# EAGLE design homeboard18 (EAGLE 6.0)
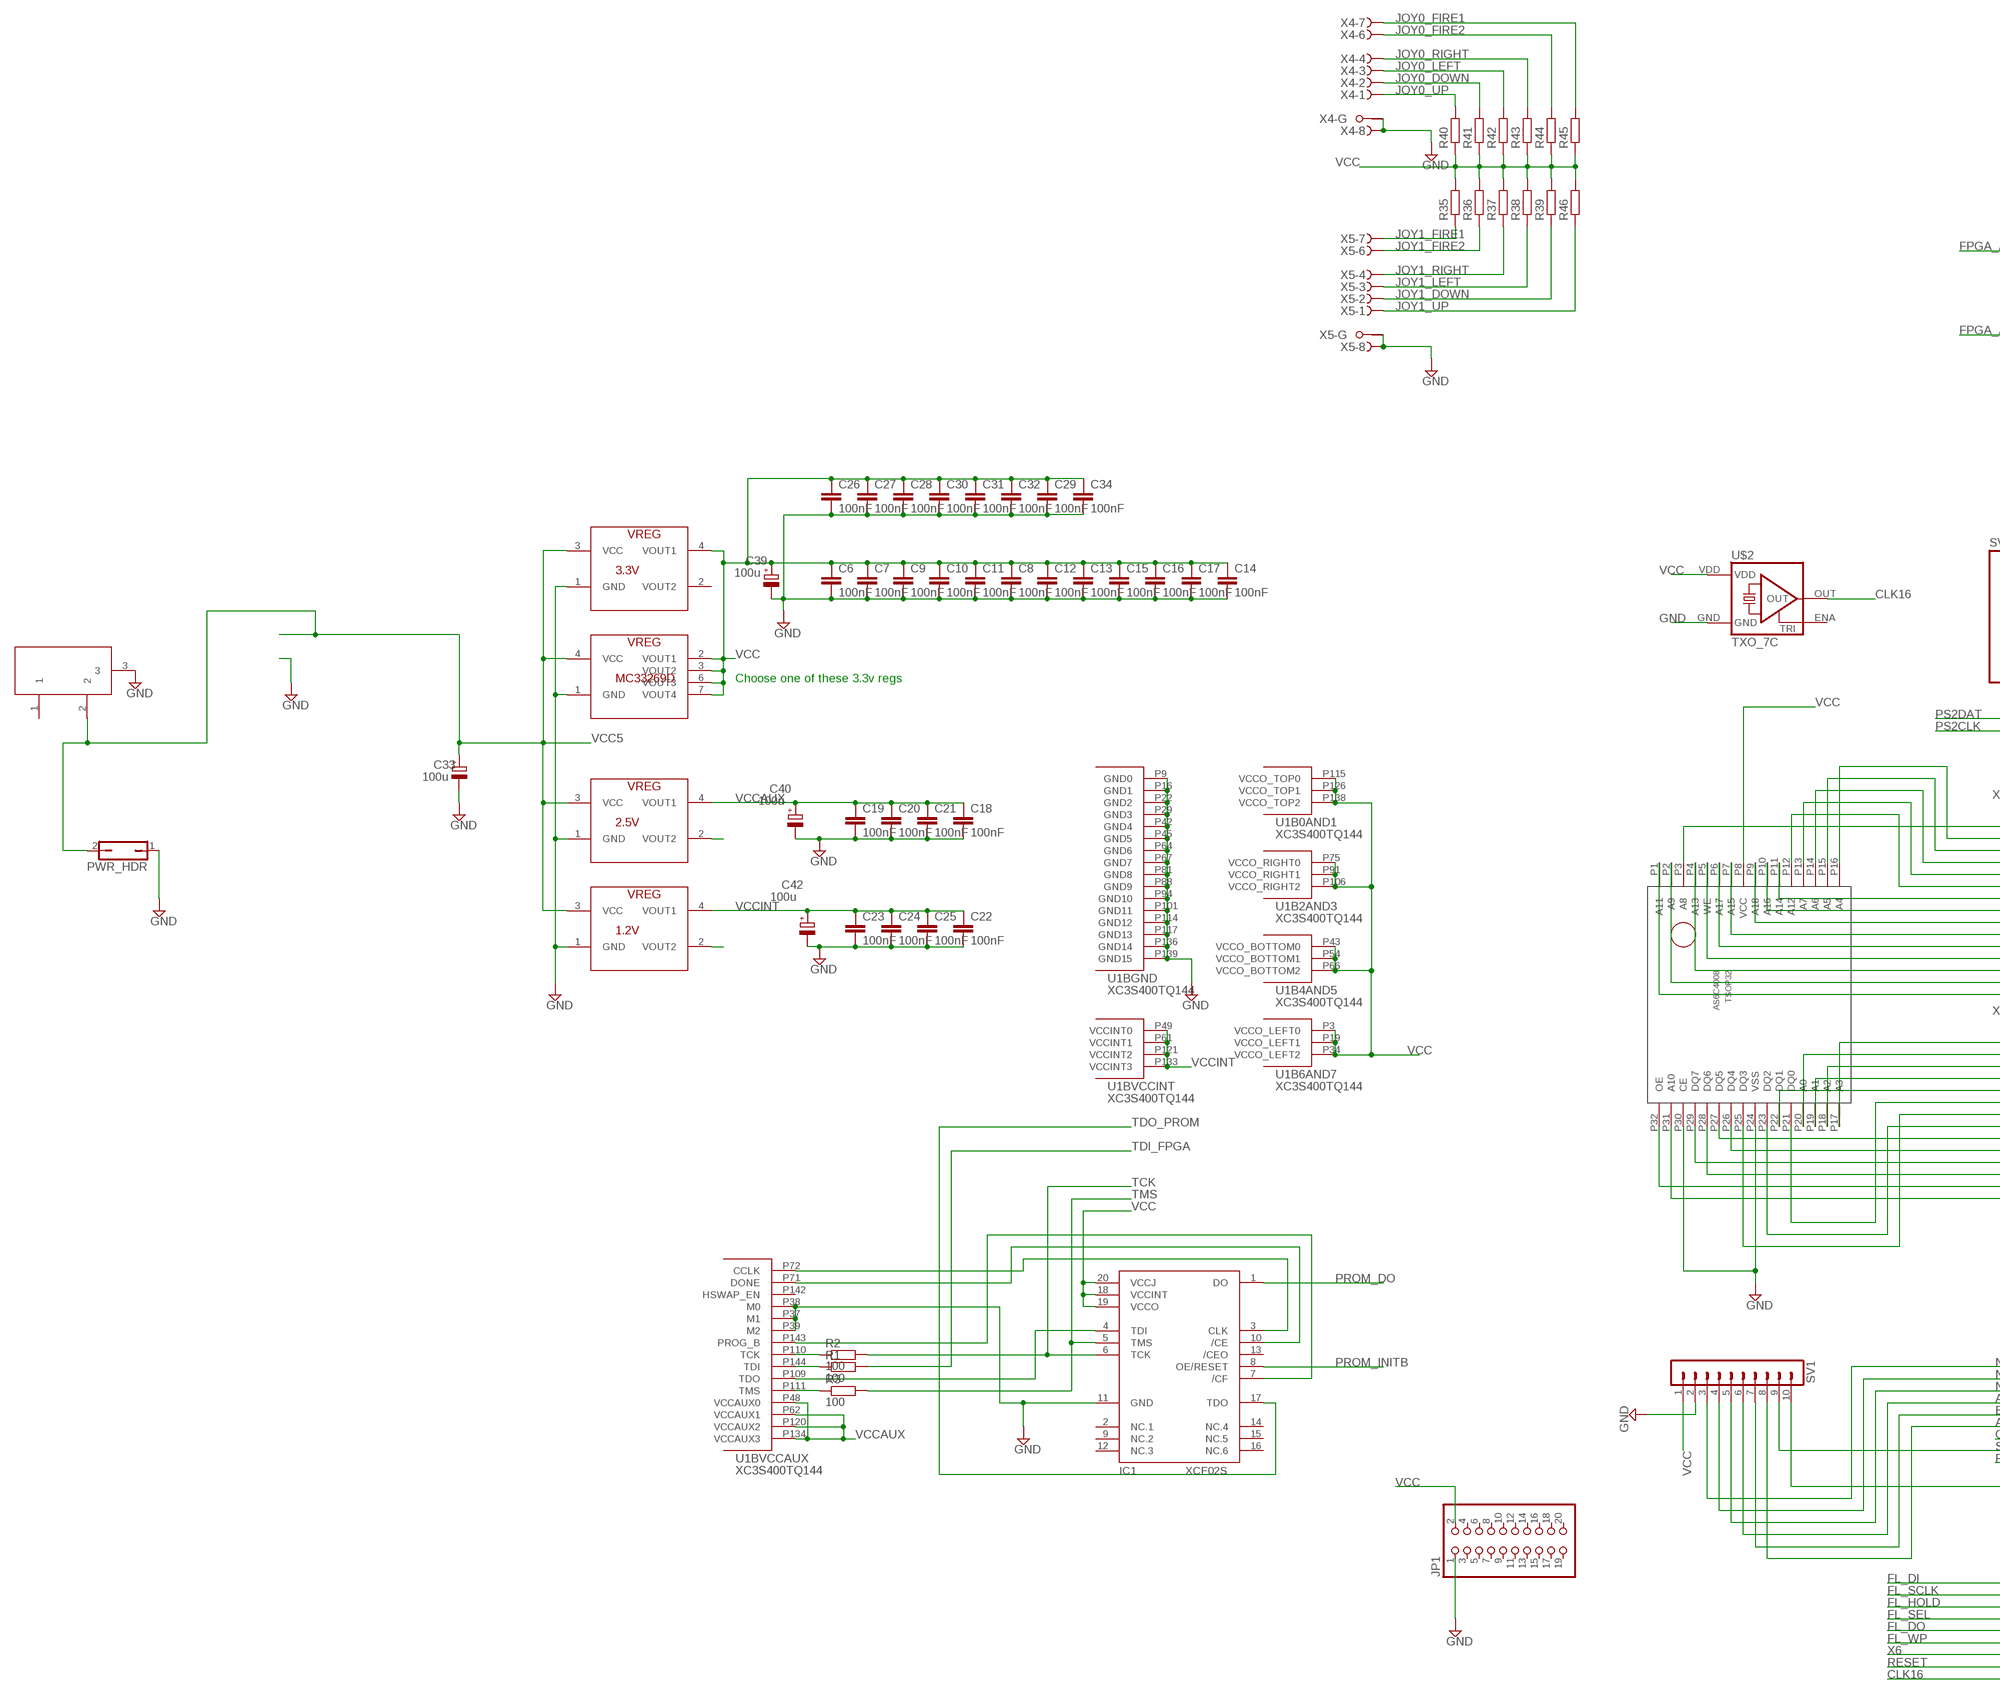
[diagram p0: schematic, sheet 1, part 1 of 3]
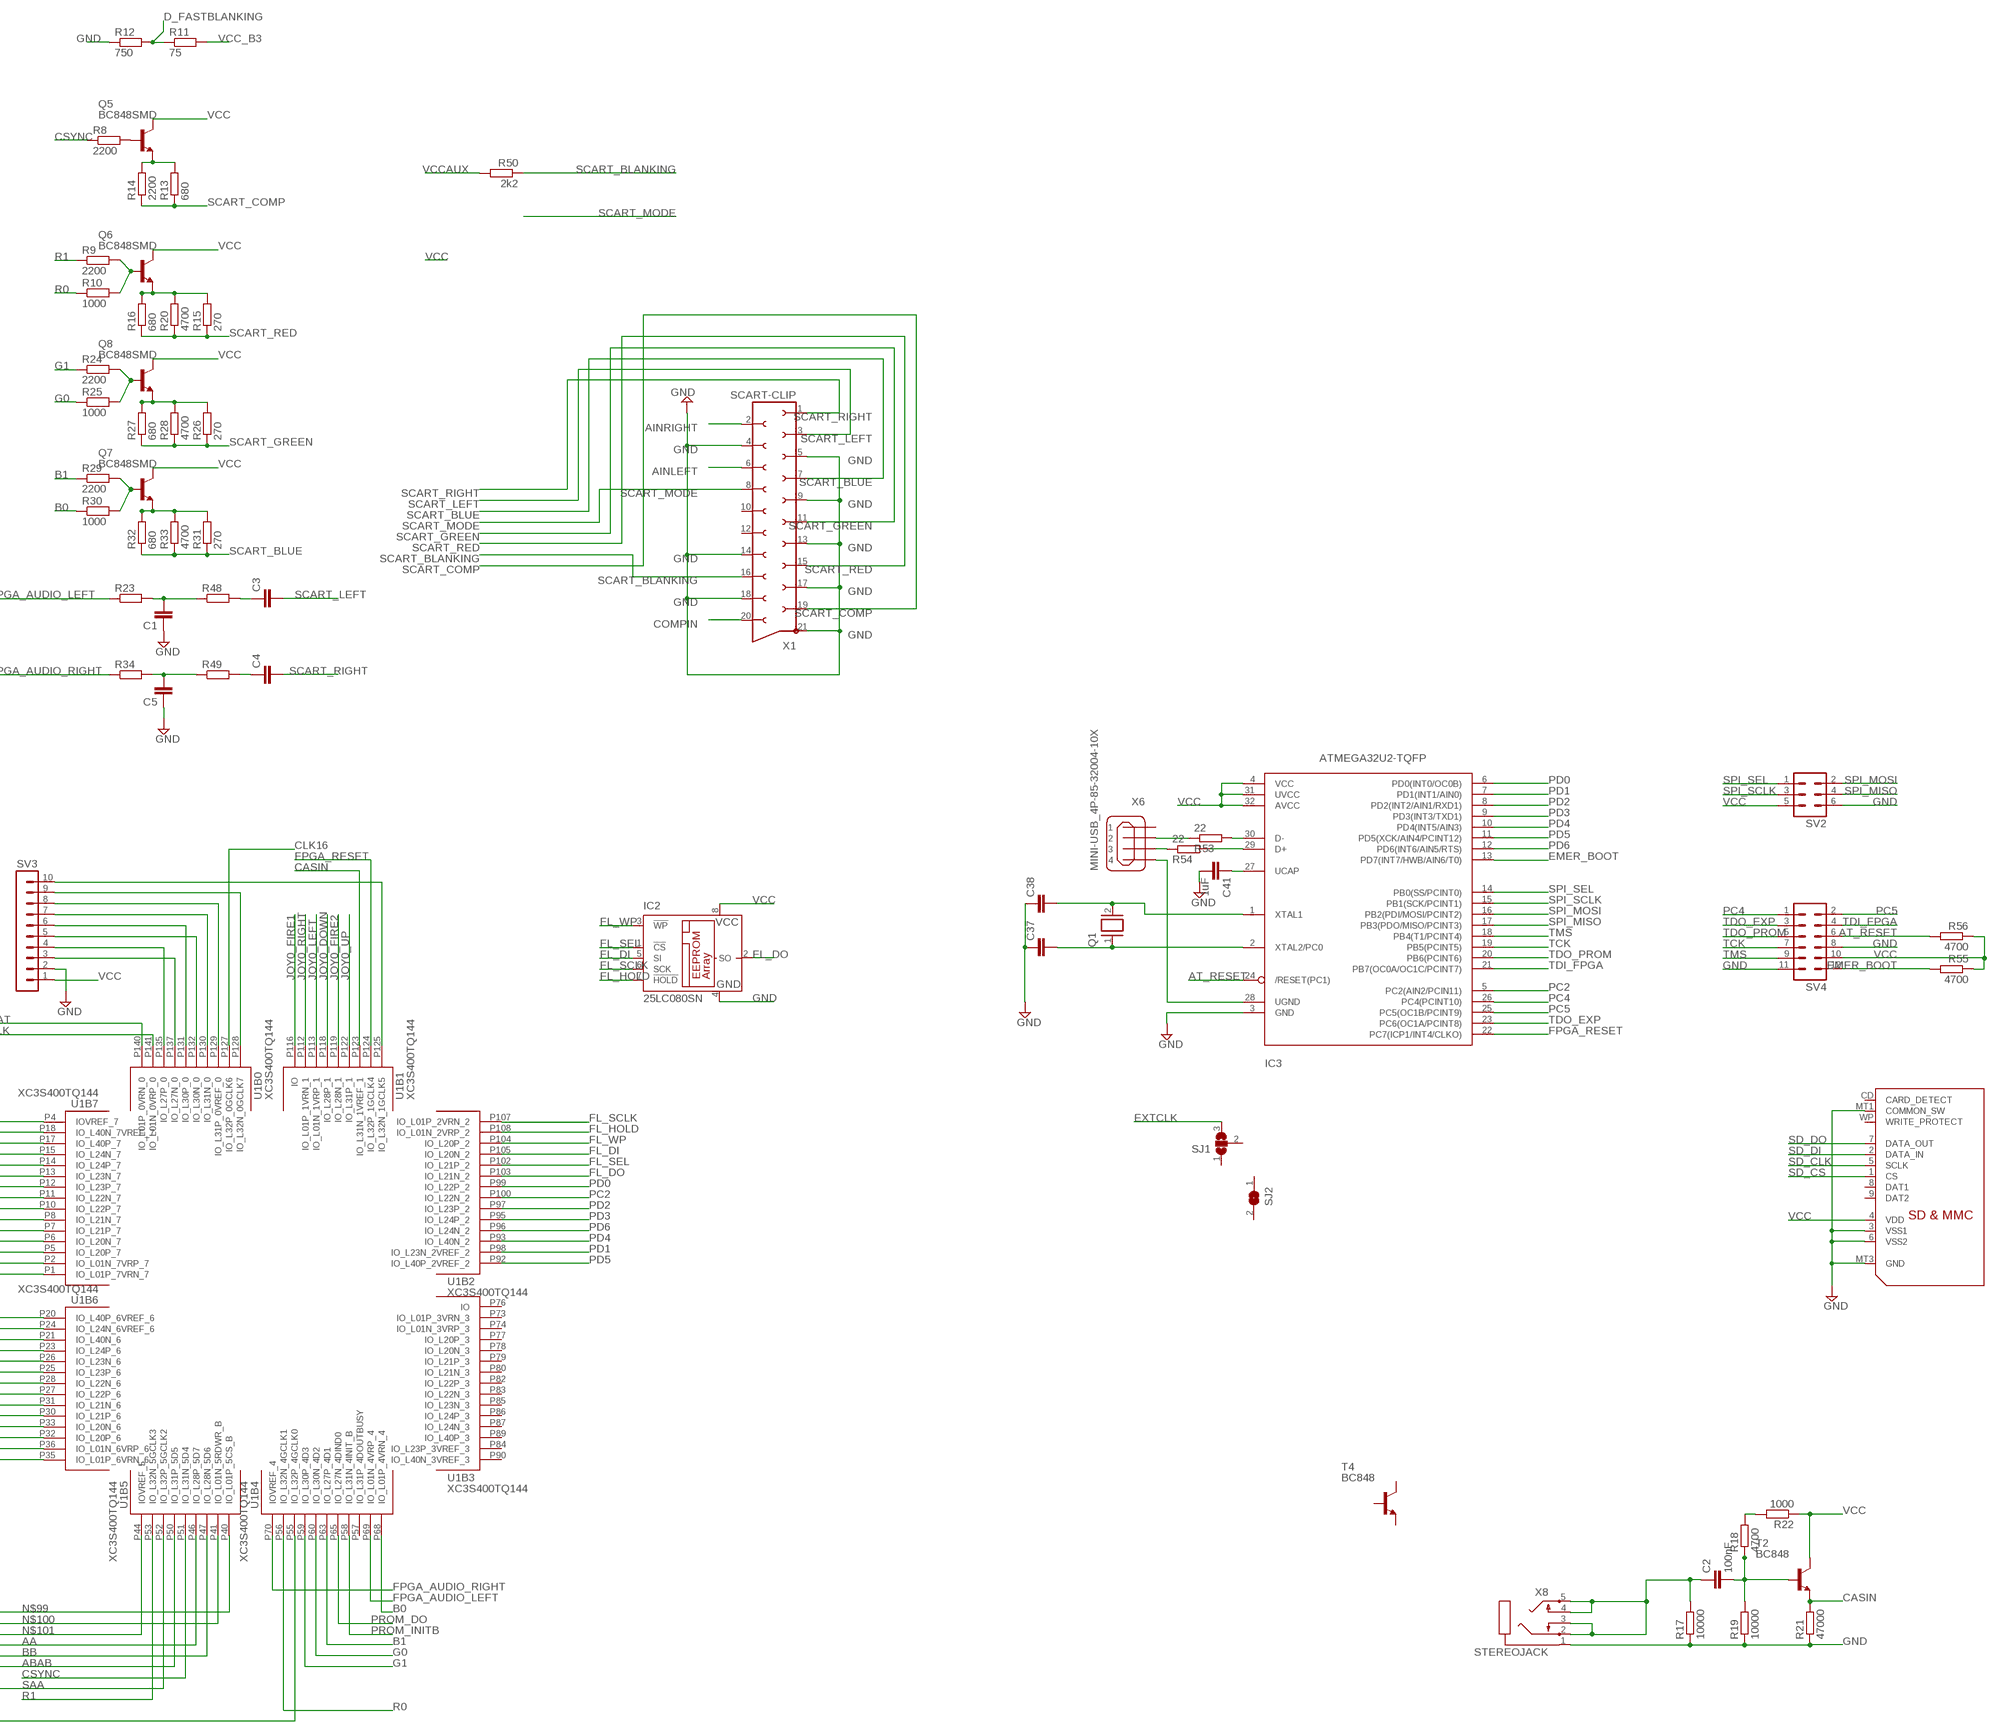
[diagram p1: schematic, sheet 1, part 2 of 3]
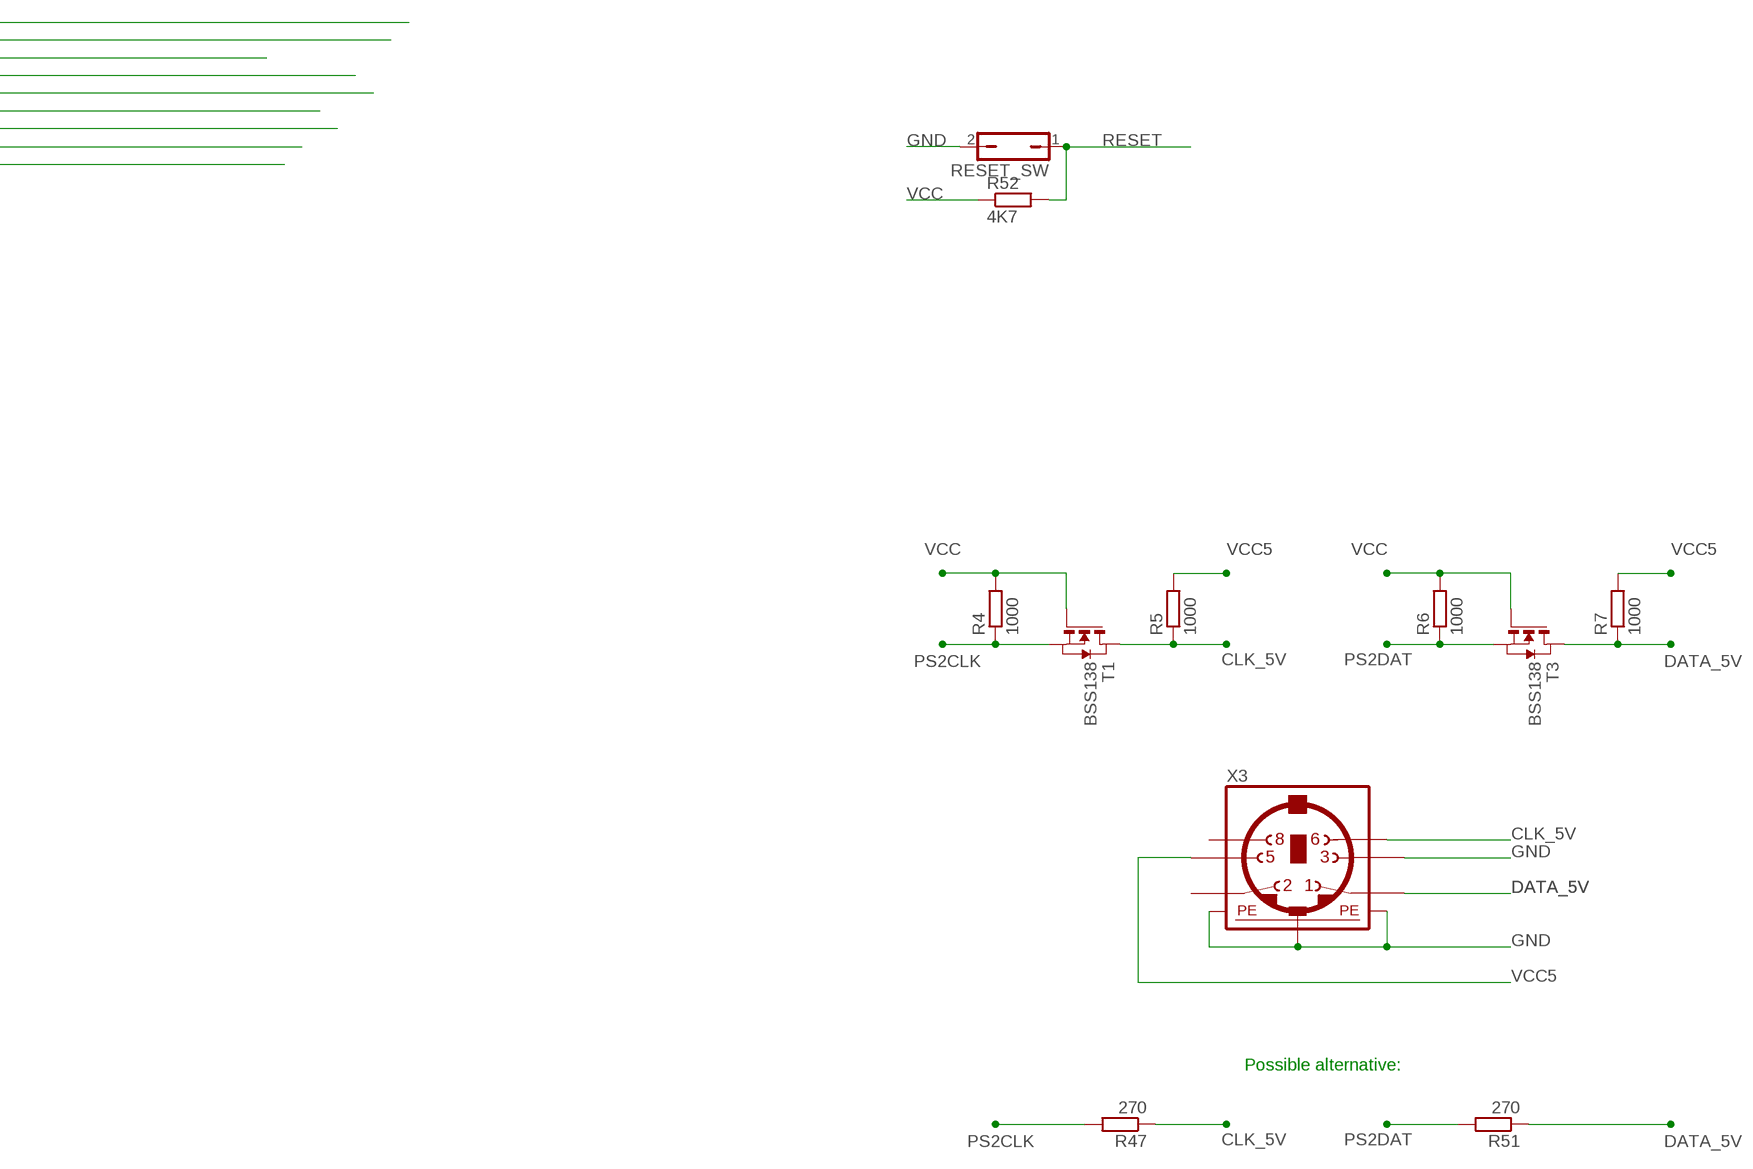
[diagram p2: schematic, sheet 1, part 3 of 3]

## Parts
C1  C-EUC0603  [C0603]
C2  100nF  C-EUC0603  [C0603]
C3  C-EUC0603  [C0603]
C4  C-EUC0603  [C0603]
C5  C-EUC0603  [C0603]
C6  100nF  C-EUC0603  [C0603]
C7  100nF  C-EUC0603  [C0603]
C8  100nF  C-EUC0603  [C0603]
C9  100nF  C-EUC0603  [C0603]
C10  100nF  C-EUC0603  [C0603]
C11  100nF  C-EUC0603  [C0603]
C12  100nF  C-EUC0603  [C0603]
C13  100nF  C-EUC0603  [C0603]
C14  100nF  C-EUC0603  [C0603]
C15  100nF  C-EUC0603  [C0603]
C16  100nF  C-EUC0603  [C0603]
C17  100nF  C-EUC0603  [C0603]
C18  100nF  C-EUC0603  [C0603]
C19  100nF  C-EUC0603  [C0603]
C20  100nF  C-EUC0603  [C0603]
C21  100nF  C-EUC0603  [C0603]
C22  100nF  C-EUC0603  [C0603]
C23  100nF  C-EUC0603  [C0603]
C24  100nF  C-EUC0603  [C0603]
C25  100nF  C-EUC0603  [C0603]
C26  100nF  C-EUC0603  [C0603]
C27  100nF  C-EUC0603  [C0603]
C28  100nF  C-EUC0603  [C0603]
C29  100nF  C-EUC0603  [C0603]
C30  100nF  C-EUC0603  [C0603]
C31  100nF  C-EUC0603  [C0603]
C32  100nF  C-EUC0603  [C0603]
C33  100u  CPOL-EUD  [PANASONIC_D]
C34  100nF  C-EUC0603  [C0603]
C37  C-EUC0805  [C0805]
C38  C-EUC0805  [C0805]
C39  100u  CPOL-EUD  [PANASONIC_D]
C40  100u  CPOL-EUD  [PANASONIC_D]
C41  1uF  C-EUC0805  [C0805]
C42  100u  CPOL-EUD  [PANASONIC_D]
IC1  XCF02S  [VO20]
IC2  25LC080SN  [SO-08]
IC3  ATMEGA32U2-TQFP  [TQFP32-08]
JP1  PINHD-2X10  [2X10]
PWR_HDR  JP1Q  [JP1]
Q1  XTAL/S  [QS]
Q5  BC848SMD  [SOT23]
Q6  BC848SMD  [SOT23]
Q7  BC848SMD  [SOT23]
Q8  BC848SMD  [SOT23]
R1  100  R-EU_R0805  [R0805]
R2  100  R-EU_R0805  [R0805]
R3  100  R-EU_R0805  [R0805]
R4  1000  R-EU_R0805  [R0805]
R5  1000  R-EU_R0805  [R0805]
R6  1000  R-EU_R0805  [R0805]
R7  1000  R-EU_R0805  [R0805]
R8  2200  R-EU_R0805  [R0805]
R9  2200  R-EU_R0805  [R0805]
R10  1000  R-EU_R0805  [R0805]
R11  75  R-EU_R0805  [R0805]
R12  750  R-EU_R0805  [R0805]
R13  680  R-EU_R0805  [R0805]
R14  2200  R-EU_R0805  [R0805]
R15  270  R-EU_R0805  [R0805]
R16  680  R-EU_R0805  [R0805]
R17  10000  R-EU_R0805  [R0805]
R18  4700  R-EU_R0805  [R0805]
R19  10000  R-EU_R0805  [R0805]
R20  4700  R-EU_R0805  [R0805]
R21  47000  R-EU_R0805  [R0805]
R22  1000  R-EU_R0805  [R0805]
R23  R-EU_M0805  [M0805]
R24  2200  R-EU_R0805  [R0805]
R25  1000  R-EU_R0805  [R0805]
R26  270  R-EU_R0805  [R0805]
R27  680  R-EU_R0805  [R0805]
R28  4700  R-EU_R0805  [R0805]
R29  2200  R-EU_R0805  [R0805]
R30  1000  R-EU_R0805  [R0805]
R31  270  R-EU_R0805  [R0805]
R32  680  R-EU_R0805  [R0805]
R33  4700  R-EU_R0805  [R0805]
R34  R-EU_M0805  [M0805]
R35  R-EU_M0805  [M0805]
R36  R-EU_M0805  [M0805]
R37  R-EU_M0805  [M0805]
R38  R-EU_M0805  [M0805]
R39  R-EU_M0805  [M0805]
R40  R-EU_M0805  [M0805]
R41  R-EU_M0805  [M0805]
R42  R-EU_M0805  [M0805]
R43  R-EU_M0805  [M0805]
R44  R-EU_M0805  [M0805]
R45  R-EU_M0805  [M0805]
R46  R-EU_M0805  [M0805]
R47  270  R-EU_R0805  [R0805]
R48  R-EU_M0805  [M0805]
R49  R-EU_M0805  [M0805]
R50  2k2  R-EU_M0805  [M0805]
R51  270  R-EU_R0805  [R0805]
R52  4K7  R-EU_M0805  [M0805]
R53  22  R-EU_R0805  [R0805]
R54  22  R-EU_R0805  [R0805]
R55  4700  R-EU_R0805  [R0805]
R56  4700  R-EU_R0805  [R0805]
REG1.2  1.2V  NX1117  [SOT223]
REG2.5  2.5V  NX1117  [SOT223]
RESET_SW  JP1Q  [JP1]
SJ1  SJ2W  [SJ_2]
SJ2  SJ  [SJ]
SV1  MA10-1  [MA10-1]
SV2  MA03-2  [MA03-2]
SV3  MA10-1  [MA10-1]
SV4  MA06-2  [MA06-2]
T1  BSS138  NMOSSOT23  [SOT-23]
T2  BC848  [SOT23]
T3  BSS138  NMOSSOT23  [SOT-23]
T4  BC848  [SOT23]
U1  XC3S400TQ144  [TQ144]
U$2  TXO_7C  [OSC_7C]
U$3  SDMMCNOHOLE  [SDCARD-NOHOLE]
U$4  3.3V  NX1117  [SOT223]
U$5  MC33269D  [SO8]
U$6  AS6C4008  [TSOP32]
X1  SCART-CLIP  [SCART-CLIP]
X3  MINI_DIN_6  [M_DIN6]
X4  F09HPS  [F09HP]
X5  F09HPS  [F09HP]
X6  MINI-USB_4P-85-32004-10X  [85-32004-10X]
X7  DC21MMX  [DC-21MM]
X8  STEREOJACK  [20-0137]

## Nets
AA: SV1.6 U1.P46(B5:IO_L28P_5D7)
ABAB: SV1.8 U1.P50(B5:IO_L31P_5D5)
AINLEFT: X1.6
AINRIGHT: X1.2
AT_RESET: IC3.24(/RESET(PC1)) R56.2 SV4.6
B0: R30.1 U1.P68(B4:IO_L01P_4VRN_4)
B1: R29.1 U1.P63(B4:IO_L27P_4D1)
BB: SV1.7 U1.P47(B5:IO_L28N_5D6)
CASIN: R21.2 T2.2(E) U1.P123(B1:IO_L31N_1VREF_1)
CLK16: U1.P127(B0:IO_L32P_0GCLK6) U$2.OUT
CLK_5V: R5.1 R47.1 T1.1(D) X3.6
COMPIN: X1.20
CSYNC: R8.1 U1.P51(B5:IO_L31N_5D4)
D_FASTBLANKING: R11.1 R12.2
DATA_5V: R7.1 R51.1 T3.1(D) X3.1
EMER_BOOT: IC3.13(PD7(INT7/HWB/AIN6/T0)) R55.2 SV4.12
EXTCLK: SJ1.3
FL_DI: IC2.5(SI) U1.P105(B2:IO_L20N_2)
FL_DO: IC2.2(SO) U1.P103(B2:IO_L21N_2)
FL_HOLD: IC2.7(!HOLD) U1.P108(B2:IO_L01N_2VRP_2)
FL_SCLK: IC2.6(SCK) U1.P107(B2:IO_L01P_2VRN_2)
FL_SEL: IC2.1(!CS) U1.P102(B2:IO_L21P_2)
FL_WP: IC2.3(!WP) U1.P104(B2:IO_L20P_2)
FPGA_AUDIO_LEFT: R23.1 U1.P69(B4:IO_L01N_4VRP_4)
FPGA_AUDIO_RIGHT: R34.1 U1.P70(B4:IOVREF_4)
FPGA_RESET: IC3.22(PC7(ICP1/INT4/CLKO)) U1.P124(B1:IO_L32P_1GCLK4)
G0: R25.1 U1.P60(B4:IO_L30N_4D2)
G1: R24.1 U1.P59(B4:IO_L30P_4D3)
GND: C1.1 C5.1 C6.2 C7.2 C8.2 C9.2 C10.2 C11.2 C12.2 C13.2 C14.2 C15.2 C16.2 C17.2 C18.2 C19.2 C20.2 C21.2 C22.2 C23.2 C24.2 C25.2 C26.2 C27.2 C28.2 C29.2 C30.2 C31.2 C32.2 C33.- C34.2 C37.1 C38.1 C39.- C40.- C41.2 C42.- IC1.11(GND) IC2.4(GND) IC3.3(GND) JP1.1 PWR_HDR.1 R12.1 R17.1 R19.1 R21.1 REG1.2.1(GND) REG2.5.1(GND) RESET_SW.2 SV1.2 SV2.6 SV3.2 SV4.8 SV4.11 U1.P9(BGND:GND0) U1.P16(BGND:GND1) U1.P22(BGND:GND2) U1.P29(BGND:GND3) U1.P37(BVCCAUX:M1) U1.P38(BVCCAUX:M0) U1.P39(BVCCAUX:M2) U1.P42(BGND:GND4) U1.P45(BGND:GND5) U1.P64(BGND:GND6) U1.P67(BGND:GND7) U1.P81(BGND:GND8) U1.P88(BGND:GND9) U1.P94(BGND:GND10) U1.P101(BGND:GND11) U1.P114(BGND:GND12) U1.P117(BGND:GND13) U1.P136(BGND:GND14) U1.P139(BGND:GND15) U$2.GND U$3.3(VSS1) U$3.6(VSS2) U$3.MT1(COMMON_SW) U$3.MT3(GND) U$4.1(GND) U$5.1(GND) U$6.P24(VSS) U$6.P30(CE) X1.4 X1.5 X1.9 X1.13 X1.14 X1.17 X1.18 X1.21 X3.3 X3.SH1(PE1) X3.SH2(PE2) X3.SH3(PE3) X4.8(-8:F) X4.G1(-G:G1) X5.8(-8:F) X5.G1(-G:G1) X7.3 X8.1
JOY0_DOWN: R41.2 U1.P118(B1:IO_L28P_1) X4.2(-2:F)
JOY0_FIRE1: R45.2 U1.P116(B1:IO) X4.7(-7:F)
JOY0_FIRE2: R44.2 U1.P119(B1:IO_L28N_1) X4.6(-6:F)
JOY0_LEFT: R42.2 U1.P113(B1:IO_L01N_1VRP_1) X4.3(-3:F)
JOY0_RIGHT: R43.2 U1.P112(B1:IO_L01P_1VRN_1) X4.4(-4:F)
JOY0_UP: R40.2 U1.P122(B1:IO_L31P_1) X4.1(-1:F)
JOY1_DOWN: R39.1 X5.2(-2:F)
JOY1_FIRE1: R35.1 X5.7(-7:F)
JOY1_FIRE2: R36.1 X5.6(-6:F)
JOY1_LEFT: R38.1 X5.3(-3:F)
JOY1_RIGHT: R37.1 X5.4(-4:F)
JOY1_UP: R46.1 X5.1(-1:F)
N$1: SV3.3 U1.P137(B0:IO_L27N_0)
N$2: SV3.4 U1.P135(B0:IO_L27P_0)
N$3: SV3.5 U1.P132(B0:IO_L30N_0)
N$4: SV3.6 U1.P131(B0:IO_L30P_0)
N$5: SV3.7 U1.P130(B0:IO_L31N_0)
N$6: SV3.8 U1.P129(B0:IO_L31P_0VREF_0)
N$7: SV3.9 U1.P128(B0:IO_L32N_0GCLK7)
N$8: SV3.10 U1.P125(B1:IO_L32N_1GCLK5)
N$9: C41.1 IC3.27(UCAP)
N$12: C37.2 IC3.2(XTAL2/PC0) Q1.1
N$14: C38.2 IC3.1(XTAL1) Q1.2
N$35: IC1.3(CLK) U1.P72(BVCCAUX:CCLK)
N$36: R53.1 X6.2
N$38: IC1.10(/CE) U1.P71(BVCCAUX:DONE)
N$39: R2.1 U1.P110(BVCCAUX:TCK)
N$40: IC1.7(/CF) U1.P143(BVCCAUX:PROG_B)
N$42: R1.1 U1.P144(BVCCAUX:TDI)
N$43: R3.1 U1.P111(BVCCAUX:TMS)
N$49: IC3.29(D+) R54.2
N$50: REG2.5.2(VOUT2)
N$51: C1.2 R23.2 R48.1
N$52: C3.1 R48.2
N$53: Q6.1(B) R9.2 R10.2
N$54: Q6.2(E) R15.2 R16.2 R20.2
N$55: Q8.1(B) R24.2 R25.2
N$56: Q8.2(E) R26.2 R27.2 R28.2
N$57: Q7.1(B) R29.2 R30.2
N$58: Q7.2(E) R31.2 R32.2 R33.2
N$59: Q5.2(E) R13.2 R14.2
N$60: C2.2 R18.1 R19.2 T2.1(B)
N$61: C2.1 R17.2 X8.2 X8.3 X8.4 X8.5
N$62: R18.2 R22.2
N$63: Q5.1(B) R8.2
N$64: C4.1 R49.2
N$65: C5.2 R34.2 R49.1
N$66: R54.1 X6.3
N$67: U1.P1(B7:IO_L01P_7VRN_7) U$6.P1(A11)
N$68: IC3.30(D-) R53.2
N$69: IC3.28(UGND) X6.4
N$70: REG1.2.2(VOUT2)
N$71: U1.P2(B7:IO_L01N_7VRP_7) U$6.P2(A9)
N$72: U1.P4(B7:IOVREF_7) U$6.P3(A8)
N$73: U1.P5(B7:IO_L20P_7) U$6.P4(A13)
N$74: U1.P6(B7:IO_L20N_7) U$6.P5(WE)
N$75: U1.P7(B7:IO_L21P_7) U$6.P6(A17)
N$76: U1.P8(B7:IO_L21N_7) U$6.P7(A15)
N$77: U1.P10(B7:IO_L22P_7) U$6.P9(A18)
N$78: U1.P11(B7:IO_L22N_7) U$6.P10(A16)
N$79: U1.P12(B7:IO_L23P_7) U$6.P11(A14)
N$80: U1.P13(B7:IO_L23N_7) U$6.P12(A12)
N$81: U1.P14(B7:IO_L24P_7) U$6.P13(A7)
N$82: U1.P15(B7:IO_L24N_7) U$6.P14(A6)
N$83: U1.P17(B7:IO_L40P_7) U$6.P15(A5)
N$84: U1.P18(B7:IO_L40N_7VREF_7) U$6.P16(A4)
N$85: U1.P20(B6:IO_L40P_6VREF_6) U$6.P17(A3)
N$86: U1.P21(B6:IO_L40N_6) U$6.P18(A2)
N$87: U1.P23(B6:IO_L24P_6) U$6.P19(A1)
N$88: U1.P24(B6:IO_L24N_6VREF_6) U$6.P20(A0)
N$89: U1.P25(B6:IO_L23P_6) U$6.P21(DQ0)
N$90: U1.P26(B6:IO_L23N_6) U$6.P22(DQ1)
N$91: U1.P27(B6:IO_L22P_6) U$6.P23(DQ2)
N$92: U1.P28(B6:IO_L22N_6) U$6.P25(DQ3)
N$93: U1.P30(B6:IO_L21P_6) U$6.P26(DQ4)
N$94: U1.P31(B6:IO_L21N_6) U$6.P27(DQ5)
N$95: U1.P32(B6:IO_L20P_6) U$6.P28(DQ6)
N$96: U1.P33(B6:IO_L20N_6) U$6.P29(DQ7)
N$97: U1.P35(B6:IO_L01P_6VRN_6) U$6.P31(A10)
N$98: U1.P36(B6:IO_L01N_6VRP_6) U$6.P32(OE)
N$99: SV1.3 U1.P40(B5:IO_L01P_5CS_B)
N$100: SV1.4 U1.P41(B5:IO_L01N_5RDWR_B)
N$101: SV1.5 U1.P44(B5:IOVREF_5)
PC2: IC3.5(PC2(AIN2/PCIN11)) U1.P100(B2:IO_L22N_2)
PC4: IC3.26(PC4(PCINT10)) SV4.1
PC5: IC3.25(PC5(OC1B/PCINT9)) SV4.2
PD0: IC3.6(PD0(INT0/OC0B)) U1.P99(B2:IO_L22P_2)
PD1: IC3.7(PD1(INT1/AIN0)) U1.P98(B2:IO_L23N_2VREF_2)
PD2: IC3.8(PD2(INT2/AIN1/RXD1)) U1.P97(B2:IO_L23P_2)
PD3: IC3.9(PD3(INT3/TXD1)) U1.P95(B2:IO_L24P_2)
PD4: IC3.10(PD4(INT5/AIN3)) U1.P93(B2:IO_L40N_2)
PD5: IC3.11(PD5(XCK/AIN4/PCINT12)) U1.P92(B2:IO_L40P_2VREF_2)
PD6: IC3.12(PD6(INT6/AIN5/RTS)) U1.P96(B2:IO_L24N_2)
PROM_DO: IC1.1(DO) U1.P65(B4:IO_L27N_4DIND0)
PROM_INITB: IC1.8(OE/RESET) U1.P58(B4:IO_L31N_4INIT_B)
PS2CLK: R4.1 R47.2 T1.2(S) U1.P141(B0:IO_L01N_0VRP_0)
PS2DAT: R6.1 R51.2 T3.2(S) U1.P140(B0:IO_L01P_0VRN_0)
R0: R10.1 U1.P56(B4:IO_L32N_4GCLK1)
R1: R9.1 U1.P53(B5:IO_L32N_5GCLK3)
RESET: R52.2 RESET_SW.1
SAA: SV1.9 U1.P52(B5:IO_L32P_5GCLK2)
SCART_BLANKING: R50.1 X1.16
SCART_BLUE: R31.1 R32.1 R33.1 X1.7
SCART_COMP: R13.1 R14.1 X1.19
SCART_GREEN: R26.1 R27.1 R28.1 X1.11
SCART_LEFT: C3.2 X1.3
SCART_MODE: X1.8
SCART_RED: R15.1 R16.1 R20.1 X1.15
SCART_RIGHT: C4.2 X1.1
SD_CLK: U$3.5(SCLK)
SD_CS: U$3.1(CS)
SD_DI: U$3.2(DATA_IN)
SD_DO: U$3.7(DATA_OUT)
SPI_MISO: IC3.17(PB3(PDO/MISO/PCINT3)) SV2.4
SPI_MOSI: IC3.16(PB2(PDI/MOSI/PCINT2)) SV2.2
SPI_SCLK: IC3.15(PB1(SCK/PCINT1)) SV2.3
SPI_SEL: IC3.14(PB0(SS/PCINT0)) SV2.1
TCK: IC1.6(TCK) IC3.19(PB5(PCINT5)) R2.2 SV4.7
TDI_FPGA: IC3.21(PB7(OC0A/OC1C/PCINT7)) R1.2 SV4.4
TDO_EXP: IC3.23(PC6(OC1A/PCINT8)) SV4.3
TDO_FPGA: IC1.4(TDI) U1.P109(BVCCAUX:TDO)
TDO_PROM: IC1.17(TDO) IC3.20(PB6(PCINT6)) SV4.5
TMS: IC1.5(TMS) IC3.18(PB4(T1/PCINT4)) R3.2 SV4.9
VCC: C6.1 C7.1 C8.1 C9.1 C10.1 C11.1 C12.1 C13.1 C14.1 C15.1 C16.1 C17.1 C26.1 C27.1 C28.1 C29.1 C30.1 C31.1 C32.1 C34.1 C39.+ IC1.18(VCCINT) IC1.19(VCCO) IC1.20(VCCJ) IC2.8(VCC) IC3.4(VCC) IC3.31(UVCC) IC3.32(AVCC) JP1.2 Q5.3(C) Q6.3(C) Q7.3(C) Q8.3(C) R4.2 R6.2 R22.1 R35.2 R36.2 R37.2 R38.2 R39.2 R40.1 R41.1 R42.1 R43.1 R44.1 R45.1 R46.2 R52.1 R55.1 R56.1 SV1.1 SV2.5 SV3.1 SV4.10 T1.3(G) T2.3(C) T3.3(G) U1.P3(B6AND7:VCCO_LEFT0) U1.P19(B6AND7:VCCO_LEFT1) U1.P34(B6AND7:VCCO_LEFT2) U1.P43(B4AND5:VCCO_BOTTOM0) U1.P54(B4AND5:VCCO_BOTTOM1) U1.P66(B4AND5:VCCO_BOTTOM2) U1.P75(B2AND3:VCCO_RIGHT0) U1.P91(B2AND3:VCCO_RIGHT1) U1.P106(B2AND3:VCCO_RIGHT2) U1.P115(B0AND1:VCCO_TOP0) U1.P126(B0AND1:VCCO_TOP1) U1.P138(B0AND1:VCCO_TOP2) U$2.VDD U$3.4(VDD) U$4.4(VOUT1) U$5.2(VOUT1) U$5.3(VOUT2) U$5.6(VOUT3) U$5.7(VOUT4) U$6.P8(VCC)
VCC5: C33.+ PWR_HDR.2 R5.2 R7.2 REG1.2.3(VCC) REG2.5.3(VCC) U$4.3(VCC) U$5.4(VCC) X3.5 X7.2
VCC_B3: R11.2
VCCAUX: C18.1 C19.1 C20.1 C21.1 C40.+ R50.2 REG2.5.4(VOUT1) U1.P48(BVCCAUX:VCCAUX0) U1.P62(BVCCAUX:VCCAUX1) U1.P120(BVCCAUX:VCCAUX2) U1.P134(BVCCAUX:VCCAUX3)
VCCINT: C22.1 C23.1 C24.1 C25.1 C42.+ REG1.2.4(VOUT1) U1.P49(BVCCINT:VCCINT0) U1.P61(BVCCINT:VCCINT1) U1.P121(BVCCINT:VCCINT2) U1.P133(BVCCINT:VCCINT3)
XXX: SV1.10 U1.P55(B4:IO_L32P_4GCLK0)
Unconnected: IC1.2(NC.1) IC1.9(NC.2) IC1.12(NC.3) IC1.13(/CEO) IC1.14(NC.4) IC1.15(NC.5) IC1.16(NC.6) JP1.3 JP1.4 JP1.5 JP1.6 JP1.7 JP1.8 JP1.9 JP1.10 JP1.11 JP1.12 JP1.13 JP1.14 JP1.15 JP1.16 JP1.17 JP1.18 JP1.19 JP1.20 SJ1.1 SJ1.2 SJ2.1 SJ2.2 T4.1(B) T4.2(E) T4.3(C) U1.P57(B4:IO_L31P_4DOUTBUSY) U1.P73(B3:IO_L01P_3VRN_3) U1.P74(B3:IO_L01N_3VRP_3) U1.P76(B3:IO) U1.P77(B3:IO_L20P_3) U1.P78(B3:IO_L20N_3) U1.P79(B3:IO_L21P_3) U1.P80(B3:IO_L21N_3) U1.P82(B3:IO_L22P_3) U1.P83(B3:IO_L22N_3) U1.P84(B3:IO_L23P_3VREF_3) U1.P85(B3:IO_L23N_3) U1.P86(B3:IO_L24P_3) U1.P87(B3:IO_L24N_3) U1.P89(B3:IO_L40P_3) U1.P90(B3:IO_L40N_3VREF_3) U1.P142(BVCCAUX:HSWAP_EN) U$2.ENA(TRI) U$3.8(DAT1) U$3.9(DAT2) U$3.CD(CARD_DETECT) U$3.WP(WRITE_PROTECT) U$4.2(VOUT2) X1.10 X1.12 X3.2 X3.8 X4.5(-5:F) X4.9(-9:F) X4.G2(-G:G2) X5.5(-5:F) X5.9(-9:F) X5.G2(-G:G2) X6.1

## Notes on the sheet
- Choose one of these 3.3v regs
- Possible alternative:

## Power pins joined to a net without a drawn wire
1: X7.1

## Library data of the parts
C1-C5 = resistor:C-EU: CAPACITOR, European symbol
C6-C32 C34 C37 C38 C41 = rcl:C-EU: CAPACITOR, European symbol
C33 C39 C40 C42 = rcl:CPOL-EU: POLARIZED CAPACITOR, European symbol
IC1 = smd-special:XCF02S
IC2 = microchip:25*: Serial EEPROM 4K/ 8K , SPI bus; MF: MICROCHIP; MPN: 25LC080/SN; OC_FARNELL: 1137302; OC_NEWARK: 96K4092
IC3 = adafruit:ATMEGA32U2: ATmega32u2 Pin compatible with the atmega8u2, atmega16u2 and atmega32u2 8, 16 or 32 K flash, 1K RAM, 512b EEPROM 8 bit and 16 bit timer (5 PWM total) UART, SPI (no I2C!) USB with 4 endpoints, LUFA compatible 22 I/O lines, analog comparator (no ADC!) Comes with DFU bootloader burned in!
JP1 = pinhead:PINHD-2X10: PIN HEADER
PWR_HDR RESET_SW = jumper:JP1Q: JUMPER
Q1 = special:XTAL/S: CRYSTAL
Q5-Q8 = bc548:BC848*: NPN Transistor
R1-R22 R24-R33 R47 R51 R53-R56 = rcl:R-EU_: RESISTOR, European symbol
R23 R34-R46 R48-R50 R52 = resistor:R-EU_: RESISTOR, European symbol
REG1.2 REG2.5 U$4 = cpcfpga:NX1117
SJ1 = jumper:SJ2W: SMD solder JUMPER
SJ2 = jumper:SJ: SMD solder JUMPER
SV1 SV3 = con-lstb:MA10-1: PIN HEADER; OC_FARNELL: unknown; OC_NEWARK: unknown
SV2 = con-lstb:MA03-2: PIN HEADER; OC_FARNELL: unknown; OC_NEWARK: unknown
SV4 = con-lstb:MA06-2: PIN HEADER; OC_FARNELL: unknown; OC_NEWARK: unknown
T1 T3 = zetex:NMOSSOT23: MOS FET; OC_FARNELL: unknown; OC_NEWARK: unknown
T2 T4 = transistor:BC848: NPN TRANSISTOR
U1 = xilinx_spartan3_virtex4_and_5:XC3S400TQ144: Xilinx FPGA
U$2 = cpcfpga:TXO_7C: TXC crystal oscillator http://www.txccrystal.com/images/pdf/7c.pdf
U$3 = cpcfpga:SDMMC: SD MMC Card holder 4UCON part #06132 - easy to solder
U$5 = cpcfpga:MC33269D
U$6 = cpcfpga:AS6C4008
X1 = cpcfpga:SCART-CLIP: TV SCART CONNECTOR; OC_FARNELL: unknown; OC_NEWARK: unknown
X3 = mini_din:MINI_DIN_6
X4 X5 = con-subd:F09HPS: SUB-D; OC_FARNELL: unknown; OC_NEWARK: unknown
X6 = con-cypressindustries:MINI-USB_4P-: MINI USB 4 Pol. Source: www.cypressindustries.com; OC_FARNELL: unknown; OC_NEWARK: unknown
X7 = powersupply:DC21MM
X8 = cpcfpga:STEREOJACK: MIC/HEADPHONE JACK Stereo jack with two switches. Kycon STX3100, CUI SJ1-3555NG and/or 4UCon 05544 modified from adafruit library

## Net classes
1 power: width 0.6 mm, drill 1.1 mm, clearance 0.4 mm
2 gnd: width 0.305 mm, drill 0.508 mm, clearance 0.152 mm

## Board
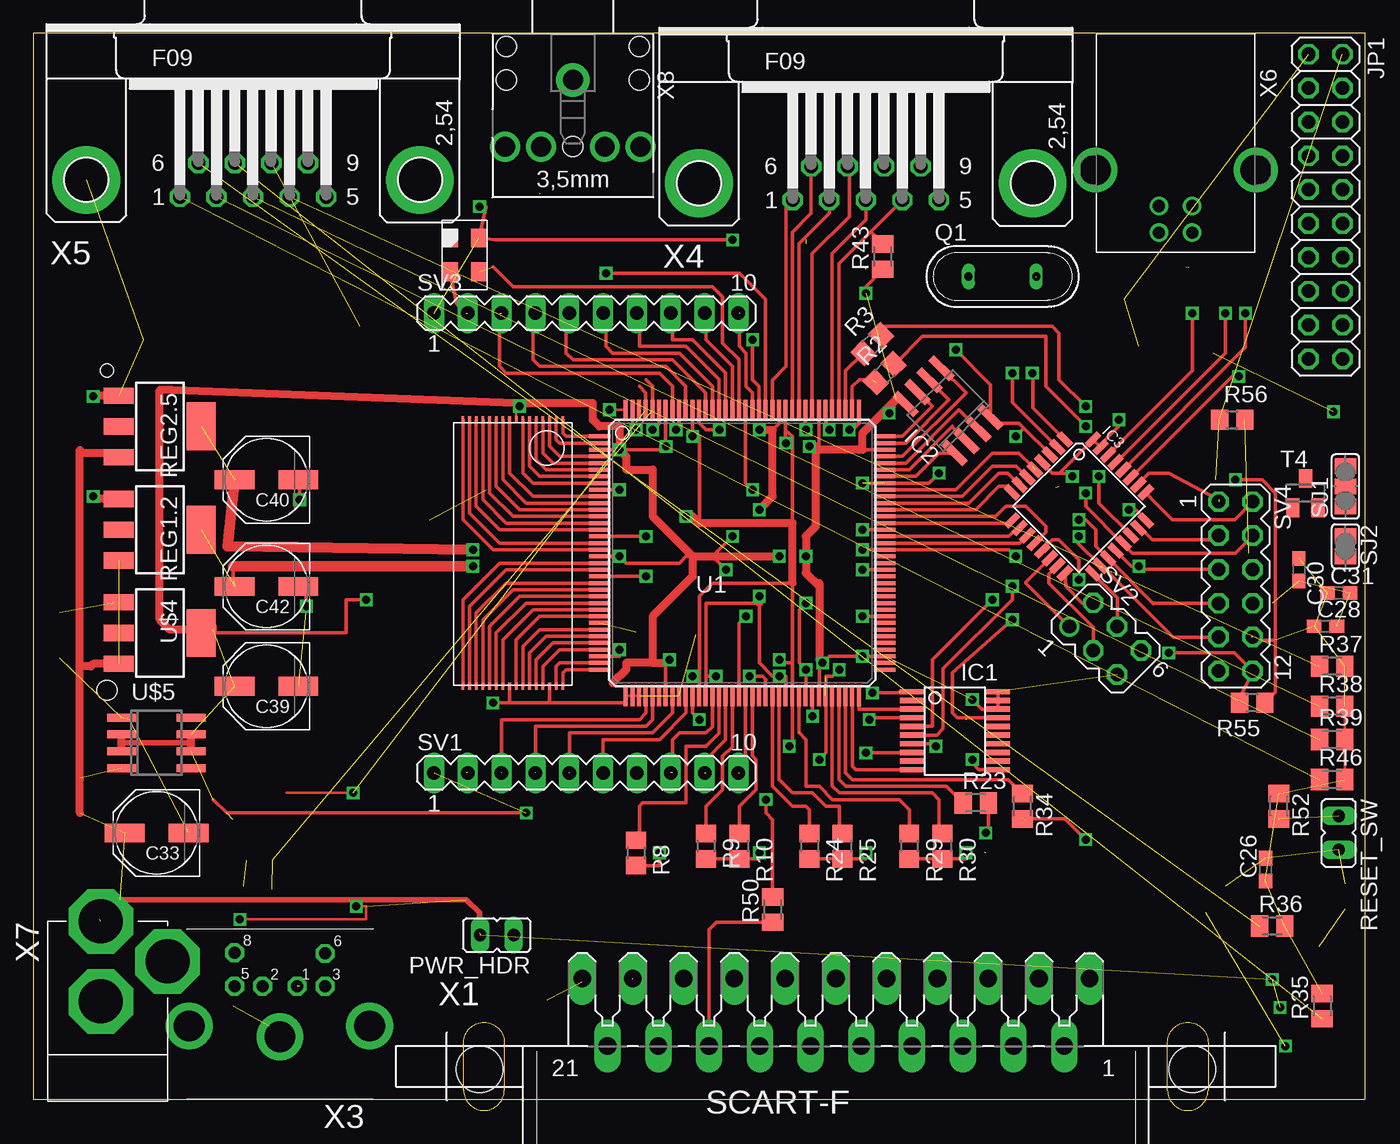
[diagram p3: board, top side]
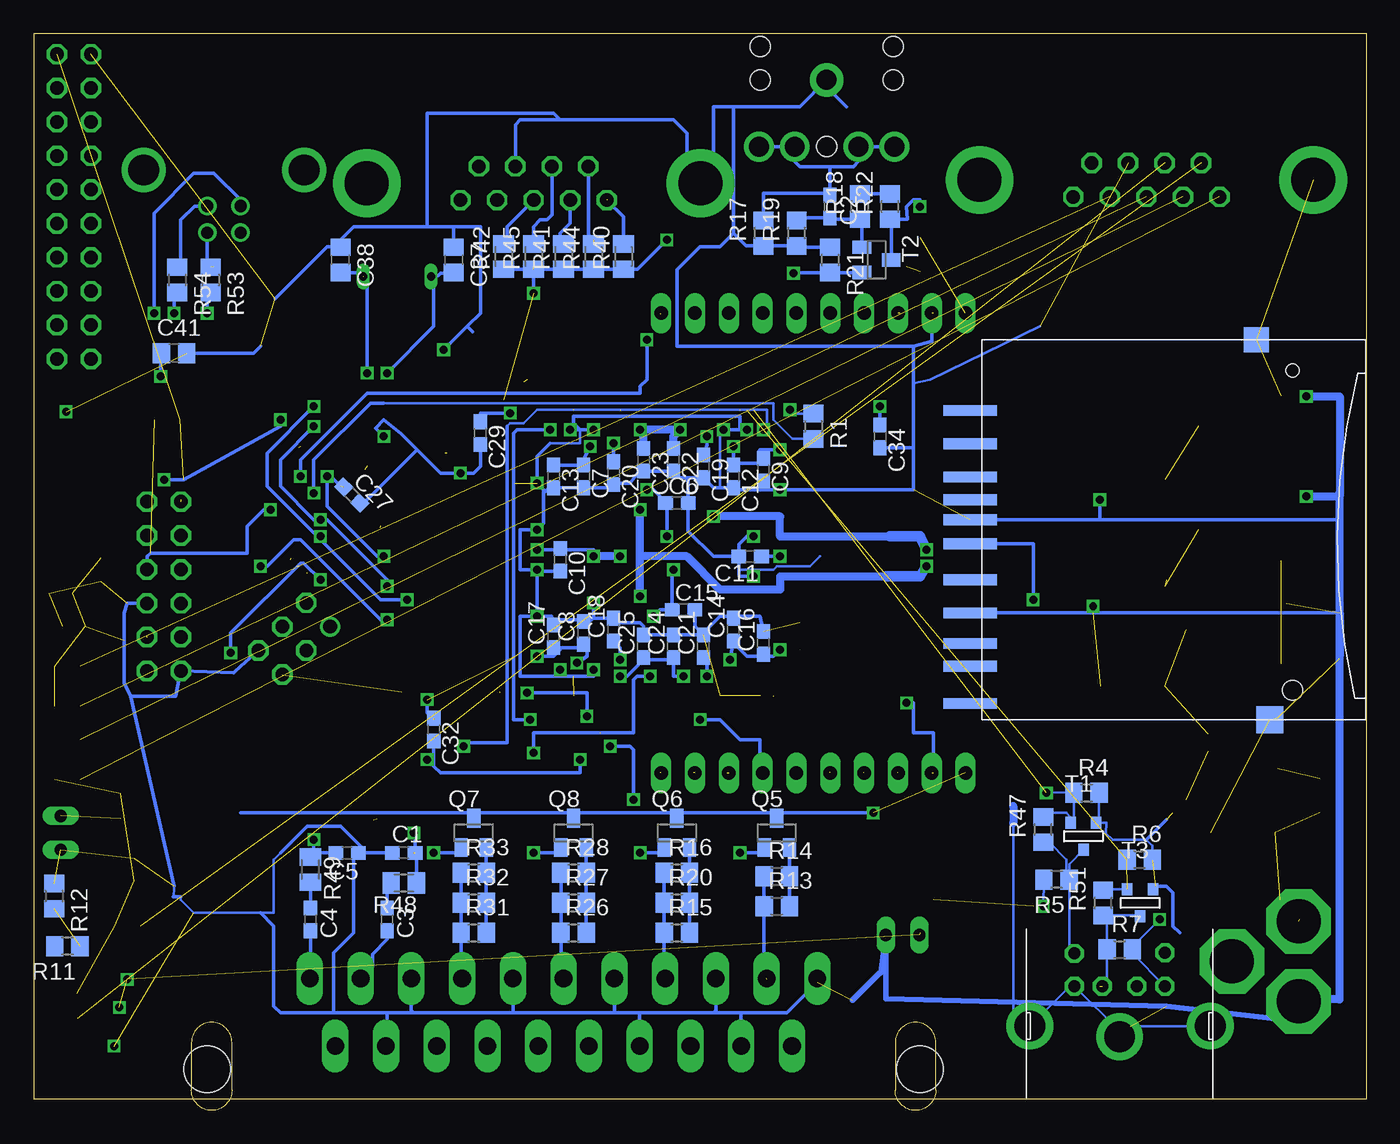
[diagram p4: board, bottom side, seen from below]

Size 100 x 80 mm. Coordinates in mm from the lower left corner, seen from the top.
Outline: 0,0 100,0 100,80 0,80 0,0
Copper layers (1*16): Top 0.0356mm / dielectric 1.5011mm / Bottom 0.0356mm
Design rules: minimum track width 6mil, minimum drill 13mil, track to track 6mil, track to pad 6mil, pad to pad 6mil, via to via 6mil, smd to smd 6mil, copper to edge 15mil, drill to drill 6mil, minimum pad ring 7mil, minimum via ring 7mil, stop-mask expansion 4mil, vias tented up to drill 0mil, thermal gap 10mil

### Footprints (pad centres in the part's own frame; a part is rotated, then mirrored left to right if it is on the bottom)
C0603 = smd 1.1 x 1: 1 -0.85,0; 2 0.85,0
PANASONIC_D = smd 3 x 1.4: + 2.4,0; - -2.4,0
C0805 = smd 1.3 x 1.5: 1 -0.95,0; 2 0.95,0
VO20 = smd 0.4 x 1.8: 1 5.85,6.15; 2 5.2,6.15; 3 4.55,6.15; 4 3.9,6.15; 5 3.25,6.15; 6 2.6,6.15; 7 1.95,6.15; 8 1.3,6.15; 9 0.65,6.15; 10 0,6.15; 11 0,-0.3; 12 0.65,-0.3; 13 1.3,-0.3; 14 1.95,-0.3; 15 2.6,-0.3; 16 3.25,-0.3; 17 3.9,-0.3; 18 4.55,-0.3; 19 5.2,-0.3; 20 5.85,-0.3
SO-08 = smd 0.6 x 2.2: 1 -1.905,-2.6; 2 -0.635,-2.6; 3 0.635,-2.6; 4 1.905,-2.6; 5 1.905,2.6; 6 0.635,2.6; 7 -0.635,2.6; 8 -1.905,2.6
TQFP32-08 = smd 1.27 x 0.508: 1 -4.293,2.8; 2 -4.293,2; 3 -4.293,1.2; 4 -4.293,0.4; 5 -4.293,-0.4; 6 -4.293,-1.2; 7 -4.293,-2; 8 -4.293,-2.8; 17 4.293,-2.8; 18 4.293,-2; 19 4.293,-1.2; 20 4.293,-0.4; 21 4.293,0.4; 22 4.293,1.2; 23 4.293,2; 24 4.293,2.8 | smd 0.508 x 1.27: 9 -2.8,-4.293; 10 -2,-4.293; 11 -1.2,-4.293; 12 -0.4,-4.293; 13 0.4,-4.293; 14 1.2,-4.293; 15 2,-4.293; 16 2.8,-4.293; 25 2.8,4.293; 26 2,4.293; 27 1.2,4.293; 28 0.4,4.293; 29 -0.4,4.293; 30 -1.2,4.293; 31 -2,4.293; 32 -2.8,4.293
2X10 = drill 1.016 octagon: 1 -11.43,-1.27; 2 -11.43,1.27; 3 -8.89,-1.27; 4 -8.89,1.27; 5 -6.35,-1.27; 6 -6.35,1.27; 7 -3.81,-1.27; 8 -3.81,1.27; 9 -1.27,-1.27; 10 -1.27,1.27; 11 1.27,-1.27; 12 1.27,1.27; 13 3.81,-1.27; 14 3.81,1.27; 15 6.35,-1.27; 16 6.35,1.27; 17 8.89,-1.27; 18 8.89,1.27; 19 11.43,-1.27; 20 11.43,1.27
JP1 = drill 0.914 long: 1 0,-1.27; 2 0,1.27
QS = drill 0.61 long: 1 -2.54,0; 2 2.54,0
SOT23 = smd 1 x 1.4: 1 -0.95,-1.1; 2 0.95,-1.1; 3 0,1.1
R0805 = smd 1.3 x 1.5: 1 -0.95,0; 2 0.95,0
M0805 = smd 1.3 x 1.6: 1 -0.95,0; 2 0.95,0
SOT223 = smd 1.219 x 2.235: 1 -2.311,-3.099; 2 0,-3.099; 3 2.311,-3.099 | smd 3.6 x 2.2: 4 0,3.099
SJ_2 = smd 1.168 x 1.6: 1 -1.524,0; 2 0,0; 3 1.524,0
SJ = smd 1.168 x 1.6: 1 -0.762,0; 2 0.762,0
MA10-1 = drill 1.016 long: 1 -11.43,0; 2 -8.89,0; 3 -6.35,0; 4 -3.81,0; 5 -1.27,0; 6 1.27,0; 7 3.81,0; 8 6.35,0; 9 8.89,0; 10 11.43,0
MA03-2 = drill 1.016: 1 -2.54,-1.27 | drill 1.016 octagon: 2 -2.54,1.27; 3 0,-1.27; 4 0,1.27; 5 2.54,-1.27; 6 2.54,1.27
MA06-2 = drill 1.016 octagon: 1 -6.35,-1.27; 2 -6.35,1.27; 3 -3.81,-1.27; 4 -3.81,1.27; 5 -1.27,-1.27; 6 -1.27,1.27; 7 1.27,-1.27; 8 1.27,1.27; 9 3.81,-1.27; 10 3.81,1.27; 11 6.35,-1.27; 12 6.35,1.27
SOT-23 = smd 0.787 x 0.889: 1 0.025,-1.016; 2 -0.94,1.016; 3 0.991,1.016
TQ144 = smd 1.6 x 0.3: P1 -10.7,8.75; P2 -10.7,8.25; P3 -10.7,7.75; P4 -10.7,7.25; P5 -10.7,6.75; P6 -10.7,6.25; P7 -10.7,5.75; P8 -10.7,5.25; P9 -10.7,4.75; P10 -10.7,4.25; P11 -10.7,3.75; P12 -10.7,3.25; P13 -10.7,2.75; P14 -10.7,2.25; P15 -10.7,1.75; P16 -10.7,1.25; P17 -10.7,0.75; P18 -10.7,0.25; P19 -10.7,-0.25; P20 -10.7,-0.75; P21 -10.7,-1.25; P22 -10.7,-1.75; P23 -10.7,-2.25; P24 -10.7,-2.75; P25 -10.7,-3.25; P26 -10.7,-3.75; P27 -10.7,-4.25; P28 -10.7,-4.75; P29 -10.7,-5.25; P30 -10.7,-5.75; P31 -10.7,-6.25; P32 -10.7,-6.75; P33 -10.7,-7.25; P34 -10.7,-7.75; P35 -10.7,-8.25; P36 -10.7,-8.75; P73 10.7,-8.75; P74 10.7,-8.25; P75 10.7,-7.75; P76 10.7,-7.25; P77 10.7,-6.75; P78 10.7,-6.25; P79 10.7,-5.75; P80 10.7,-5.25; P81 10.7,-4.75; P82 10.7,-4.25; P83 10.7,-3.75; P84 10.7,-3.25; P85 10.7,-2.75; P86 10.7,-2.25; P87 10.7,-1.75; P88 10.7,-1.25; P89 10.7,-0.75; P90 10.7,-0.25; P91 10.7,0.25; P92 10.7,0.75; P93 10.7,1.25; P94 10.7,1.75; P95 10.7,2.25; P96 10.7,2.75; P97 10.7,3.25; P98 10.7,3.75; P99 10.7,4.25; P100 10.7,4.75; P101 10.7,5.25; P102 10.7,5.75; P103 10.7,6.25; P104 10.7,6.75; P105 10.7,7.25; P106 10.7,7.75; P107 10.7,8.25; P108 10.7,8.75 | smd 0.3 x 1.6: P37 -8.75,-10.7; P38 -8.25,-10.7; P39 -7.75,-10.7; P40 -7.25,-10.7; P41 -6.75,-10.7; P42 -6.25,-10.7; P43 -5.75,-10.7; P44 -5.25,-10.7; P45 -4.75,-10.7; P46 -4.25,-10.7; P47 -3.75,-10.7; P48 -3.25,-10.7; P49 -2.75,-10.7; P50 -2.25,-10.7; P51 -1.75,-10.7; P52 -1.25,-10.7; P53 -0.75,-10.7; P54 -0.25,-10.7; P55 0.25,-10.7; P56 0.75,-10.7; P57 1.25,-10.7; P58 1.75,-10.7; P59 2.25,-10.7; P60 2.75,-10.7; P61 3.25,-10.7; P62 3.75,-10.7; P63 4.25,-10.7; P64 4.75,-10.7; P65 5.25,-10.7; P66 5.75,-10.7; P67 6.25,-10.7; P68 6.75,-10.7; P69 7.25,-10.7; P70 7.75,-10.7; P71 8.25,-10.7; P72 8.75,-10.7; P109 8.75,10.7; P110 8.25,10.7; P111 7.75,10.7; P112 7.25,10.7; P113 6.75,10.7; P114 6.25,10.7; P115 5.75,10.7; P116 5.25,10.7; P117 4.75,10.7; P118 4.25,10.7; P119 3.75,10.7; P120 3.25,10.7; P121 2.75,10.7; P122 2.25,10.7; P123 1.75,10.7; P124 1.25,10.7; P125 0.75,10.7; P126 0.25,10.7; P127 -0.25,10.7; P128 -0.75,10.7; P129 -1.25,10.7; P130 -1.75,10.7; P131 -2.25,10.7; P132 -2.75,10.7; P133 -3.25,10.7; P134 -3.75,10.7; P135 -4.25,10.7; P136 -4.75,10.7; P137 -5.25,10.7; P138 -5.75,10.7; P139 -6.25,10.7; P140 -6.75,10.7; P141 -7.25,10.7; P142 -7.75,10.7; P143 -8.25,10.7; P144 -8.75,10.7
OSC_7C = smd 1.4 x 1.2: ENA -1.27,-1.1; GND 1.27,-1.1; OUT 1.27,1.1; VDD -1.27,1.1
SDCARD-NOHOLE = smd 0.8 x 4 bottom: 1 7.8,0.99; 2 10.3,0.99; 3 13.5,0.99; 4 15.3,0.99; 5 18,0.99; 6 20.5,0.99; 7 22.8,0.99; 8 24.5,0.99; 9 5.3,0.99; CD 12,0.99; WP 27.3,0.99 | smd 2.032 x 2.032 bottom: MT1 28.5,-21.5 | smd 1.9 x 1.9 bottom: MT3 0,-20.5 | hole 1.5: 26.3,-23.21 | hole 1: 2.3,-23.21
SO8 = smd 0.6 x 2.2: 1 -1.905,-2.6; 2 -0.635,-2.6; 3 0.635,-2.6; 4 1.905,-2.6; 5 1.905,2.6; 6 0.635,2.6; 7 -0.635,2.6; 8 -1.905,2.6
TSOP32 = smd 0.5 x 0.2: P1 -9.75,3.75; P2 -9.75,3.25; P3 -9.75,2.75; P4 -9.75,2.25; P5 -9.75,1.75; P6 -9.75,1.25; P7 -9.75,0.75; P8 -9.75,0.25; P9 -9.75,-0.25; P10 -9.75,-0.75; P11 -9.75,-1.25; P12 -9.75,-1.75; P13 -9.75,-2.25; P14 -9.75,-2.75; P15 -9.75,-3.25; P16 -9.75,-3.75; P17 10.25,-3.75; P18 10.25,-3.25; P19 10.25,-2.75; P20 10.25,-2.25; P21 10.25,-1.75; P22 10.25,-1.25; P23 10.25,-0.75; P24 10.25,-0.25; P25 10.25,0.25; P26 10.25,0.75; P27 10.25,1.25; P28 10.25,1.75; P29 10.25,2.25; P30 10.25,2.75; P31 10.25,3.25; P32 10.25,3.75
SCART-CLIP = drill 1.321 long: 1 19.05,5.08; 2 17.145,0; 3 15.24,5.08; 4 13.335,0; 5 11.43,5.08; 6 9.525,0; 7 7.62,5.08; 8 5.715,0; 9 3.81,5.08; 10 1.905,0; 11 0,5.08; 12 -1.905,0; 13 -3.81,5.08; 14 -5.715,0; 15 -7.62,5.08; 16 -9.525,0; 17 -11.43,5.08; 18 -13.335,0; 19 -15.24,5.08; 20 -17.145,0; 21 -19.05,5.08 | hole 3.5: 26.75,-1.75; -26.75,-1.75
M_DIN6 = drill 0.9 pad 1.422 octagon: 1 -1.3,-3.75; 2 1.3,-3.75; 3 -3.4,-3.75; 5 3.4,-3.75; 6 -3.4,-6.2; 8 3.4,-6.25 | drill 2.3 pad 3.5: SH1 6.8,-0.75; SH2 0,0.05; SH3 -6.75,-0.75
F09HP = drill 1.016 octagon: 1 -5.486,-1.27; 2 -2.743,-1.27; 3 0,-1.27; 4 2.743,-1.27; 5 5.486,-1.27; 6 -4.115,1.27; 7 -1.372,1.27; 8 1.372,1.27; 9 4.115,1.27 | drill 3.302 pad 5.08: G1 -12.522,0; G2 12.522,0
85-32004-10X = drill 0.92 pad 1.27: 1 4.71,-1.25; 2 4.71,1.25; 3 2.71,1.25; 4 2.71,-1.25 | drill 2.3 pad 3: M1 0,6.02; M2 0,-6.02
DC-21MM = drill 3.302 pad 4.826 octagon: 1 -5.08,-3.353; 2 -0.076,-6.35; 3 -0.076,-0.356
20-0137 = drill 1.5 pad 2.54: 1 -5,0 | drill 1.5: 2 0,5.1; 3 0,2.4; 4 0,-2.4; 5 0,-5.1 | hole 1.5: -5,5; -5,-5; 0,0; -7.5,5; -7.5,-5

### Placement (x,y rotation side)
C1  72.25,18.5 0 bottom
C2  40.25,67 270 bottom
C3  73.5,13.5 270 bottom
C4  79.25,13.5 270 bottom
C5  76.5,18.5 180 bottom
C6  51.75,44.75 0 bottom
C7  58.75,46.75 270 bottom
C8  58.75,35 90 bottom
C9  45.25,47.25 270 bottom
C10  60.5,40.5 270 bottom
C11  46.25,40.75 180 bottom
C12  47.5,46.75 270 bottom
C13  61,46.75 270 bottom
C14  47.5,35.25 90 bottom
C15  51.25,36.75 0 bottom
C16  45.25,34.25 90 bottom
C17  61,34.75 90 bottom
C18  56.5,35.25 90 bottom
C19  49.75,47.5 270 bottom
C20  56.5,47 270 bottom
C21  49.75,34 90 bottom
C22  52,48 270 bottom
C23  54.25,48 270 bottom
C24  52,34 90 bottom
C25  54.25,34 90 bottom
C26  92.5,17.25 90 top
C27  76.15,45.35 315 bottom
C28  97,35.5 0 top
C29  66.5,50 270 bottom
C30  95,39.75 270 top
C31  98,38 0 top
C32  70,27.75 270 bottom
C33  9.25,20 180 top
C34  36.5,49.75 270 bottom
C37  68.5,63 270 bottom
C38  77,63 270 bottom
C39  17.5,31 180 top
C40  17.5,46.5 180 top
C41  89.5,56 0 bottom
C42  17.5,38.5 180 top
IC1  72.09,24.74 90 top
IC2  68.67,51.68 45 top
IC3  78.5,44.5 315 top
JP1  97,67 270 top
PWR_HDR  34.8,12.34 90 top
Q1  72.75,61.75 0 top
Q5  44.25,20 0 bottom
Q6  51.75,20 0 bottom
Q7  67,20 0 bottom
Q8  59.5,20 0 bottom
R1  41.5,50.51 270 bottom
R2  63.92,54.5 45 top
R3  62.99,56.68 45 top
R4  21,23 0 bottom
R5  23.25,16.5 180 bottom
R6  17,18 0 bottom
R7  18.5,11.25 0 bottom
R8  45.25,18.5 270 top
R9  50.5,19 270 top
R10  53,19 270 top
R11  97.5,11.5 180 bottom
R12  98.5,15.25 270 bottom
R13  44.25,14.5 0 bottom
R14  44.25,16.75 0 bottom
R15  51.75,12.5 0 bottom
R16  51.75,17 0 bottom
R17  45.25,65 90 bottom
R18  38,67 90 bottom
R19  42.75,65 90 bottom
R20  51.75,14.75 0 bottom
R21  40.25,63 270 bottom
R22  35.75,67 90 bottom
R23  70.75,22.25 0 top
R24  58.25,19 270 top
R25  60.75,19 270 top
R26  59.5,12.5 0 bottom
R27  59.5,14.75 0 bottom
R28  59.5,17 0 bottom
R29  65.75,19 270 top
R30  68.25,19 270 top
R31  67,12.5 0 bottom
R32  67,14.75 0 bottom
R33  67,17 0 bottom
R34  74.25,22 270 top
R35  96.75,7 90 top
R36  93,13 0 top
R37  97.5,32.5 0 top
R38  97.5,29.5 0 top
R39  97.5,27 0 top
R40  55.75,63.25 90 bottom
R41  60.25,63.25 90 bottom
R42  64.75,63.25 90 bottom
R43  63.75,63.25 90 top
R44  58,63.25 90 bottom
R45  62.5,63.25 90 bottom
R46  97.5,24 0 top
R47  24.25,20.25 90 bottom
R48  72.25,16.25 180 bottom
R49  79.25,17.25 270 bottom
R50  55.5,14.25 90 top
R51  19.75,14.75 90 bottom
R52  93.5,22 270 top
R53  86.75,61.5 270 bottom
R54  89.25,61.5 270 bottom
R55  91.5,29.75 180 top
R56  90,51 0 top
REG1.2  9.5,42.75 270 top
REG2.5  9.5,50.5 270 top
RESET_SW  98,20 180 top
SJ1  98.5,46 90 top
SJ2  98.5,41.5 270 top
SV1  41.5,24.5 0 top
SV2  80.47,34.57 315 top
SV3  41.5,59 0 top
SV4  90.25,38.5 270 top
T1  21.25,19.75 0 bottom
T2  36.75,63 270 bottom
T3  17,14.75 0 bottom
T4  95.5,45.5 0 top
U1  53.22,41 0 top
U$2  32.38,63.38 270 top
U$3  28.75,57 270 top
U$4  9.5,35 270 top
U$5  9.25,26.75 270 top
U$6  36,41.25 270 top
X1  60.25,4 0 top
X3  18.5,4.75 180 top
X4  62.5,68.75 0 top
X5  16.5,69 0 top
X6  85.75,69.75 270 top
X7  5,7 180 top
X8  40.5,71.5 270 top

### Tracks (layer width: path | path; a pad name or v marks a point on that pad's centre or on a via)
AA
  Top 0.254: U1.P46 49,29.8 49,29 47,27 42.75,27 42.75,24.52 SV1.6
ABAB  (1 unrouted)
  Top 0.254: U1.P50 50.97,27.97 50.5,27.5 48.5,27.5 48,27 48,24.5
AT_RESET  (via drill 0.6)  (1 unrouted)
  Top 0.254: IC3.24 83.52,43.48 82.75,44.25 v82.25,44.25
  Bottom 0.254: v82.25,44.25 82.75,44.25 84,43 84,41 91.25,41 91.5,40.75 91.5,40.5 | 91.5,40.5 91.5,39.77 | SV4.6 91.52,40.48 91.5,40.5
B0
  Top 0.254: U1.P68 59.97,23.53 60.5,23 67.5,23 68,22.5 68,20.2 R30.1
B1  (1 unrouted)
  Top 0.254: U1.P63 57.47,27.53 | R29.1 65.75,21.75 65,22.5 60,22.5 59,23.5 58,23.5 58,27 57.5,27.5
BB  (via drill 0.6)
  Top 0.254: U1.P47 49.5,29.8 49.5,29 v50,28.5
  Bottom 0.254: v50,28.5 48.5,28.5 47,27 45.5,27 45.5,24.69 SV1.7
CASIN  (via drill 0.6)
  Top 0.254: U1.P123 54.97,60.03 53,62 v43,62
  Bottom 0.254: T2.2 R21.2 42.95,62.05 v43,62
CLK16  (1 unrouted)
  Top 0.254: U1.P127 52.97,55.53 51.75,56.75 51.75,60.25 51,61 36,61 34.5,62.5
CLK_5V
  Bottom 0.2: R5.1 22.3,11.35 X3.6 | R47.1 23.8,19.3 22.5,18 22.5,16.5 R5.1 | R5.1 22.3,17.66 T1.1
CSYNC
  Top 0.254: U1.P51 51.47,27.47 50.5,26.5 49,26.5 49,22.25 45.75,22.25 45.5,22 45.5,19.7 R8.1
D_FASTBLANKING  (1 unrouted)
DATA_5V  (1 unrouted)
  Bottom 0.2: T3.1 17.04,13.8 R51.1 19.45,13.5 R7.1 19.45,9.05 20,8.5
EMER_BOOT  (via drill 0.6)
  Top 0.254: IC3.13 75.75,41.25 76.5,42 77,42 78.5,40.5 v78.5,39 | v85.25,33.5 90.17,33.5 SV4.12 91.52,32.02 90.5,30 90.3,30 | 90,30 90.3,30 | 90.3,30 R55.2
  Bottom 0.254: v78.5,39 79.75,40.25 80,40.25 85.25,35 v85.25,33.5
FL_DI
  Top 0.254: U1.P105 65.25,48.25 70,53 70,53.05 IC2.5
FL_DO
  Top 0.254: U1.P103 65.75,47.25 69,50.5 69,50.46 IC2.2
FL_HOLD
  Top 0.254: U1.P108 65.25,49.75 67.5,52 66.5,53 66.46,53 IC2.7
FL_SCLK
  Top 0.254: U1.P107 65.5,49.25 68.75,52.5 IC2.6
FL_SEL  (1 unrouted)
  Top 0.254: U1.P102 66.25,46.75 68,48.5 69,48.5
FL_WP
  Top 0.254: U1.P104 65.5,47.75 69.5,51.75 IC2.3
FPGA_AUDIO_LEFT
  Top 0.254: U1.P69 60.47,24.03 61,23.5 68.55,23.5 R23.1
FPGA_AUDIO_RIGHT
  Top 0.254: U1.P70 60.97,24.53 61.5,24 73.2,24 R34.1
FPGA_RESET  (via drill 0.6)
  Top 0.254: U1.P124 54.47,53.53 54,54 v54,57 | IC3.22 82.38,42.37 80,44.75 v80,46.75
  Bottom 0.254: v54,57 54,54 54.5,53.5 54.5,53 75,53 80,48 v80,46.75
G0
  Top 0.254: U1.P60 55.97,24 56,24 57,23 58.5,23 59.5,22 60.5,22 60.5,20.2 R25.1
G1
  Top 0.254: U1.P59 55.47,23.5 56.97,22 58,22 58.25,21.75 R24.1
GND  (via drill 0.6)  (32 unrouted)
  Top 0.2: U1.P37 U1.P38 U1.P39
  Top 0.254: U1.P9 v44,45.75 | U1.P22 v46,39.25 | U1.P16 v46,42.25 | v46.5,50.25 47,50.75 47,51.75 | U1.P136 48.47,50.78 v48.25,50.25 | U1.P81 v62.25,36.25 | U1.P88 v62.25,39.75 | U1.P94 v62.25,42.75 | v60.5,32.25 60,31.75 59.5,31.75 59.5,26 v59,25.5 | U1.P64 58,29.83 v58,32.25 57.5,32.75 57.5,36.75 v58,37.25 | U1.P117 57.97,50.28 v58,50.25 | v59.75,50.25 59.5,50.25 59.5,51.75 | U$2.GND 31.77,59.73 32.5,59 | v69.25,56.25 71.86,53.64 IC2.4 71.94,51.19 72,51.25 72.5,50.75 74,50.75 74.38,50.38 | IC3.3 76.31,48.44 74.38,50.38 | v73.75,49.75 74.38,50.38 | v70.5,25.5 70.5,25.25 71,24.75 IC1.11 | v62.25,46.25 67.25,46.25 v68,47 | U$6.P30 38.75,29.75 | 38.75,29.75 44.5,29.75 44.5,30.25 | U$6.P24 35.75,29.75 | 35.75,29.75 38.75,29.75 | 35.75,29.75 v34.5,29.75 | C42.- 20.5,39 v20.5,37 | C40.- 20,46.5 v20,45
  Top 0.6: 6,37.25 6.4,37.25 U$4.1
  Top 0.61: REG2.5.1 4.56,52.81 v4.5,52.75 | REG1.2.1 4.69,45.06 v4.5,45.25
  Bottom 0.2: 26.5,20.75 26.5,6.5 25.5,5.5 X3.SH3 22.25,8.5 X3.3 18.5,5.1 X3.SH2 17.7,5.5 X3.SH1 | 41,40.75 41.75,40 44.25,40 44.5,39.75 47.1,39.75 | 34,53.75 32.75,54 24.5,58 | 48.5,50 48.5,46 | 81.5,18.5 82,18 82,14 83,14 88,14 89,15 89,15.21 | 89.54,15.21 89.5,15.67 89.5,16 | 61.25,49.25 59,49.25 59,50.25
  Bottom 0.254: 89,15.21 89.54,15.21 | 92.75,30.25 93.25,31.25 93.25,36.5 93.02,37.23 SV4.8 | 92.75,30.25 89.5,16 | 45.5,45.75 v44,45.75 34,45.75 34,48.9 | C9.2 45.5,45.75 | v62.25,36.25 61.15,36.25 C17.2 60.75,36 58.5,36 C8.2 58.4,35.75 58.05,36.1 58,36.1 | v62.25,39.75 62.15,39.65 C10.2 | 61.75,45.5 61.75,43.25 v62.25,42.75 63.5,42.75 63.5,39.75 v62.25,39.75 | 61.75,45.5 61.75,45.75 v62.25,46.25 62.25,48.25 61.25,49.25 | v60.5,32.25 61,31.75 | 61,31.75 63.5,31.75 63.5,36.25 v62.25,36.25 | v58,32.25 58,31.75 61,31.75 | 47.65,36.25 45.5,36.25 C16.2 | C21.2 C24.2 C25.2 54.25,35.5 54.5,35.75 56.15,35.75 C18.2 58,36.1 | v62.25,36.25 v62.25,39.75 | v58,37.25 58,36.1 | C15.2 50.4,35.5 C21.2 | C21.2 49.75,35 48.5,36.25 47.65,36.25 | 47.65,36.25 C14.2 | 48.5,50 v48.25,50.25 47,50.25 | 47,50.25 v46.5,50.25 | 56.5,46.25 55.25,46.25 54.6,47.15 C23.2 C22.2 51.5,46.65 51,46.65 | 56.5,46.25 56.65,46.25 C20.2 | 51,46.65 C19.2 49,45.9 C12.2 47.35,45.75 45.5,45.75 | v58,50.25 59,50.25 | 59,50.25 v59.75,50.25 | 56.5,46.25 56.85,45.9 C7.2 C13.2 61.35,45.9 61.75,45.5 | 51,46.65 50.9,46.55 C6.2 50.9,42.65 49,40.75 C11.2 | 34,48.9 34,53.75 34,56.5 | 47,50.25 47,51.25 59.5,51.25 59.5,50.75 59,50.25 | v46,42.25 46.5,42.25 47.1,41.65 C11.2 | C11.2 47.1,39.75 47.1,39.35 47,39.25 v46,39.25 | C1.1 75.5,18.5 | 75.5,18.5 C5.1 | 81.5,18.5 79.5,20.5 77,20.5 75.5,19 75.5,18.5 | C34.2 34,48.9 | 34,56.5 51.75,56.5 51.75,62.25 50,64 48.5,64 47.5,65 | SV3.2 32.61,56.89 34,56.5 | 39,74.5 40.5,76 X8.1 42.5,74.5 47.5,74.5 | R21.1 42.65,63.95 R19.1 R17.1 46.55,64.05 47.5,65 | 47.5,65 47.5,74.5 | X4.G1 49,70.23 49,74.5 47.5,74.5 | X4.8 63.87,73.13 63.5,73.5 60.5,73.5
  Bottom 0.254: 60.5,73.5 52,73.5 51,72.5 51,70 50,69 | X1.21 41.2,8.8 43.5,6.5 47,6.5 | 47,6.5 49,6.5 | 49,6.5 54.5,6.5 | 54.5,6.5 56.5,6.5 | 56.5,6.5 64,6.5 | 64,6.5 71.5,6.5 | 73.5,6.5 73.5,4.08 X1.4 | X1.5 71.68,6.68 71.5,6.5 | X1.9 64.06,6.56 64,6.5 | X1.13 56.44,6.56 56.5,6.5 | X1.14 54.53,6.46 54.5,6.5 | X1.17 48.82,6.68 49,6.5 | X1.18 46.91,6.42 47,6.5 | 71.5,6.5 73.5,6.5 | 73.5,6.5 77.5,6.5 | 77.5,6.5 81.5,6.5 82,7 82,13 83,14 | v69.25,56.25 67.5,58 | 67.5,58 66.5,59 66.5,65.5 68.5,65.5 | 68.5,65.5 70.5,65.5 | 70.5,65.5 70.5,74 61,74 60.5,73.5 | v73.75,49.75 74.38,50.38 73.75,51 72.5,50 71.25,48.75 | v59,25.5 59,24.5 69.5,24.5 70,25 | 70,25 v70.5,25.5 | C32.2 70,25 | v68,47 69.5,47 71.25,48.75 | C27.2 75.25,44.75 71.25,48.75 | C29.2 66.5,47.5 67,47 v68,47 | 67.5,47 v68,47 | 70.5,65.5 76,65.5 77,64.5 C38.1 77.05,64 78,64 81.9,60.1 | 68.5,65.5 C37.1 | 67.1,57.6 67.5,58 | 92.75,30.25 89.38,30.25 SV4.11 | 88.92,32.21 SV4.11 | 77.5,6.5 77.5,11 76,12.5 76,18 75.5,18.5 | C41.2 83.5,56 83,56.5 | SV2.6 84.5,32.5 85,32 SV4.11 | v34.5,29.75 34,29.75 34,27.5 32.5,27.5 32.5,24.5 | U$3.6 20.5,36.5 | 20.5,36.5 2,36.5 | v20.5,37 20.5,36.5 | U$3.3 20,43.5 | 20,43.5 2,43.5 | v20,45 20,43.5
  Bottom 0.406: X7.3 6.43,6 15,7 36.07,7.57 PWR_HDR.1 36.41,9.5 36.5,9.5 38.55,7.45
  Bottom 0.6: 2,33.09 2,33.25 | 2,36.5 2,7.5 4.93,7.5 X7.3 | 2,43.5 2,45.5
  Bottom 0.61: 26.5,22 26.5,20.75 | 2,33.25 2,36.5 2,43.5 2,45.25 | 2,45.25 2,45.5 2,52.75 v4.5,52.75 | v4.5,45.25 2,45.25
  other vias: 97.59,51.59 94,4
JOY0_DOWN
  Top 0.254: U1.P118 57.47,64.21 59.76,66.5 X4.2
  Bottom 0.254: 60,64.45 R41.2 60.5,64.45 60.5,65 59.76,65.74 X4.2
JOY0_FIRE1
  Top 0.254: U1.P116 58.47,63.47 61.25,66.25 61.25,69.9 X4.7
  Bottom 0.254: X4.7 61.13,66.37 61.5,66 62,66 62.5,65.5 R45.2
JOY0_FIRE2  (1 unrouted)
  Top 0.254: U1.P119 56.97,65.08 58.38,66.5 X4.6
  Bottom 0.254: X4.6 58.38,64.89 58,64.5
JOY0_LEFT
  Top 0.254: U1.P113 59.97,63.47 62.5,66 X4.3
  Bottom 0.254: X4.3 62.52,67.48 64.5,65.5 64.5,64.45 R42.2
JOY0_RIGHT
  Top 0.254: U1.P112 60.47,62.71 62.88,65.12 | 62.88,65.12 X4.4 | R43.2 63.75,64.25 62.88,65.12
JOY0_UP  (1 unrouted)
  Top 0.254: U1.P122 55.47,53.97 56.5,55 56.5,67 57,67.5
  Bottom 0.254: R40.2 55.75,66.22 X4.1
JOY1_DOWN  (1 unrouted)
  Top 0.2: 96.55,26.88 R39.1
JOY1_FIRE1  (1 unrouted)
JOY1_FIRE2  (1 unrouted)
JOY1_LEFT  (1 unrouted)
JOY1_RIGHT  (1 unrouted)
JOY1_UP  (1 unrouted)
N$1  (1 unrouted)
  Top 0.254: U1.P137 47.97,53.53 47,54.5 35.5,54.5 35,55 35,59
N$2
  Top 0.254: U1.P135 48.97,53.53 47.5,55 38,55 37.5,55.5 37.5,58.81 SV3.4
N$3
  Top 0.254: U1.P132 50.47,53.03 48,55.5 40.5,55.5 40,56 40,58.77 SV3.5
N$4
  Top 0.254: U1.P131 50.97,53.53 48.5,56 43.5,56 43,56.5 43,58.77 SV3.6
N$5
  Top 0.254: U1.P130 51.47,54.03 49,56.5 45.5,56.5 45.5,58.81 SV3.7
N$6
  Top 0.254: U1.P129 51.97,54.53 49.5,57 48,57 48,58.85 SV3.8
N$7
  Top 0.254: U1.P128 52.47,55.03 50.5,57 50.5,58.89 SV3.9
N$8  (1 unrouted)
  Top 0.254: 52.97,58.96 SV3.10 | U1.P125 53.97,53.03 53.5,53.5 53.5,56 53,56.5 53,59
N$9  (via drill 0.6)
  Top 0.254: IC3.27 82.44,46.69 90,54.25 v90.5,54.25
  Bottom 0.254: 90.25,54.25 v90.5,54.25 90.5,55.95 C41.1
N$12  (via drill 0.6)
  Top 0.254: v73.5,54.5 73.5,52.33 IC3.2
  Bottom 0.254: v73.5,54.5 70,58 70,61.5 | 70,61.5 70,61.54 Q1.1 | C37.2 68.5,62 69.5,62 70,61.5
N$14  (via drill 0.6)  (1 unrouted)
  Top 0.254: IC3.1 75.04,51.92 75.04,54.46 v75,54.5
  Bottom 0.254: v75,54.5 75,61.5 75.25,61.75 | C38.2 75.59,62.05 Q1.2
N$35
  Top 0.254: IC1.3 61.98,29.29 U1.P72
N$36  (1 unrouted)
  Bottom 0.254: X6.2 87,63 86.5,62.5 87,62.5
N$38
  Top 0.254: IC1.10 61.76,24.74 61.5,25 61.5,30.27 U1.P71
N$39  (1 unrouted)
  Top 0.254: U1.P110 61.47,53.47 62,54 63,54
N$40  (via drill 0.6)
  Top 0.2: U1.P143 44.97,50.53 v45.25,50.25
  Top 0.254: IC1.7 67.56,26.69 v67.75,26.5
  Bottom 0.2: v45.25,50.25 45,50.5 45,51.75 62.25,51.75 63.25,50.75 64.25,50.75 64.5,50.5
  Bottom 0.254: 64.5,50.5 64.5,26.75 67.25,26.75 v67.75,26.5
N$42  (via drill 0.6)
  Top 0.2: v43.25,51.75 44.42,51.75 U1.P144
  Bottom 0.2: R1.1 42.96,51.46 v43.25,51.75
N$43
  Top 0.254: U1.P111 60.97,54.66 R3.1
N$49  (via drill 0.6)
  Top 0.254: IC3.29 81.32,47.82 89.5,56 v89.5,59
  Bottom 0.254: v89.5,59 89.5,60.3 R54.2
N$50
  Top 0.254: REG2.5.2 6.65,50.75
N$51  (via drill 0.6)  (1 unrouted)
  Top 0.254: R23.2 71.7,20.3 v71.5,20
  Bottom 0.254: R48.1 71.3,18.3 71.5,18.5 | C1.2 71.4,19.9 v71.5,20
N$52
  Bottom 0.254: C3.1 73.5,16 73.25,16.25 R48.2
N$53  (via drill 0.6)
  Top 0.254: v54.5,18.5 54.5,18.05 R10.2 R9.2
  Bottom 0.254: v54.5,18.5 52.7,18.5 Q6.1
N$54
  Bottom 0.254: R15.2 R20.2 R16.2 Q6.2
N$55  (via drill 0.6)
  Top 0.254: v62.5,18.5 62.5,18.05 R25.2 R24.2
  Bottom 0.254: v62.5,18.5 60.45,18.5 Q8.1
N$56
  Bottom 0.254: R26.2 R27.2 R28.2 Q8.2
N$57  (via drill 0.6)
  Top 0.254: v70,18.5 70,18.05 R30.2 R29.2
  Bottom 0.254: v70,18.5 67.95,18.5 Q7.1
N$58
  Bottom 0.254: R31.2 R32.2 R33.2 Q7.2
N$59
  Bottom 0.254: R13.2 R14.2 Q5.2
N$60
  Bottom 0.254: T2.1 37.85,65.9 R18.1 40.15,66.05 C2.2 42.55,66.15 R19.2
N$61
  Bottom 0.254: X8.5 X8.4 38.1,70.4 38.5,70 40.25,70 | X8.2 X8.3 42.9,70.4 42.5,70 40.25,70 | 40.5,68 40.4,68 C2.1 | R17.2 45.25,68 40.5,68 | 40.5,68 40.25,68.25 40.25,70
N$62  (1 unrouted)
  Bottom 0.254: R22.2 37.95,67.95 38,68 37.5,68
N$63  (via drill 0.6)
  Top 0.254: R8.2 47,17.55 v47,18.5
  Bottom 0.254: v47,18.5 45.2,18.5 Q5.1
N$64
  Bottom 0.254: C4.1 79.25,15.75 79.5,16 79.25,16.25 R49.2
N$65  (via drill 0.6)  (1 unrouted)
  Top 0.254: v79,19.5 77.45,21.05 74.55,21.05 74.5,21
  Bottom 0.254: v79,19.5 79,18.5 C5.2 78.95,18.5 R49.1
N$66
  Bottom 0.254: X6.3 87.96,67.04 89,66 89,62.7 R54.1
N$67
  Top 0.254: U$6.P1 39.75,50 40,49.75 U1.P1
N$68  (via drill 0.6)
  Top 0.254: v87,59 87,54.7 IC3.30
  Bottom 0.254: v87,59 87,60.3 R53.2
N$69  (via drill 0.6)
  Top 0.254: v91,59 91,56.43 IC3.28
  Bottom 0.254: X6.4 84.5,67.5 86.5,69.5 88,69.5 91,66.5 v91,59
N$71
  Top 0.254: U$6.P2 39.25,49.5 39.5,49.25 U1.P2
N$72
  Top 0.254: U$6.P3 38.75,49 39.5,48.25 U1.P4
N$73
  Top 0.254: U$6.P4 38.25,48.5 39,47.75 U1.P5
N$74
  Top 0.254: U$6.P5 37.75,48 38.5,47.25 U1.P6
N$75
  Top 0.254: U$6.P6 37.25,47.5 38,46.75 U1.P7
N$76
  Top 0.254: U$6.P7 36.75,47 37.5,46.25 U1.P8
N$77
  Top 0.254: U$6.P9 35.75,47 37.5,45.25 U1.P10
N$78
  Top 0.254: U$6.P10 35.25,46.5 37,44.75 U1.P11
N$79
  Top 0.254: U$6.P11 34.75,46 36.5,44.25 U1.P12
N$80
  Top 0.254: U$6.P12 34.25,45.5 36,43.75 U1.P13
N$81
  Top 0.254: U$6.P13 33.75,45 35.5,43.25 U1.P14
N$82
  Top 0.254: U$6.P14 33.25,44.5 35,42.75 U1.P15
N$83
  Top 0.254: U$6.P15 32.75,44 35,41.75 U1.P17
N$84
  Top 0.254: U$6.P16 32.25,43.5 34.5,41.25 U1.P18
N$85
  Top 0.254: U$6.P17 32.25,37.5 35,40.25 U1.P20
N$86
  Top 0.254: U$6.P18 32.75,37 35.5,39.75 U1.P21
N$87
  Top 0.254: U$6.P19 33.25,36.5 35.5,38.75 U1.P23
N$88
  Top 0.254: U$6.P20 33.75,36 36,38.25 U1.P24
N$89
  Top 0.254: U$6.P21 34.25,35.5 36.5,37.75 U1.P25
N$90
  Top 0.254: U$6.P22 34.75,35 37,37.25 U1.P26
N$91
  Top 0.254: U$6.P23 35.25,34.5 37.5,36.75 U1.P27
N$92
  Top 0.254: U$6.P25 36.25,34.5 38,36.25 U1.P28
N$93
  Top 0.254: U$6.P26 36.75,34 38,35.25 U1.P30
N$94
  Top 0.254: U$6.P27 37.25,33.5 38.5,34.75 U1.P31
N$95
  Top 0.254: U$6.P28 37.75,33 39,34.25 U1.P32
N$96  (1 unrouted)
  Top 0.254: U$6.P29 38.25,32.5 39.5,33.75 42.5,33.75
N$97
  Top 0.254: U$6.P31 39.25,32.5 39.5,32.75 U1.P35
N$98
  Top 0.254: U$6.P32 39.75,32 40,32.25 U1.P36
N$99  (1 unrouted)
  Top 0.254: U1.P40 46,29.8 46,29 45.5,28.5 35.15,28.5 35.15,24.54
N$100  (1 unrouted)
  Top 0.254: U1.P41 46.5,29.8 46.5,28.5 46,28 37.69,28 37.69,24.54
N$101  (1 unrouted)
  Top 0.254: U1.P44 48,29.8 48,29 46.5,27.5 40.25,27.5 40.25,24.56
PC2  (1 unrouted)
  Top 0.254: U1.P100 69.25,45.75 72,48.5 74,48.5 75,47.5
PC4  (1 unrouted)
  Top 0.254: IC3.26 82.95,46.2 83.75,47 85.25,47 89,45
PC5
  Top 0.254: IC3.25 84.02,44.98 85.5,43.5 90.19,43.5 91.52,44.83 SV4.2
PD0
  Top 0.254: U1.P99 69.75,45.25 72,47.5 73.8,47.5 IC3.6
PD1
  Top 0.254: U1.P98 70.25,44.75 72.5,47 73.17,47 IC3.7
PD2
  Top 0.254: U1.P97 70.75,44.25 72.5,46 73.04,46 IC3.8
PD3
  Top 0.254: U1.P95 73.29,43.25 IC3.9
PD4  (1 unrouted)
  Top 0.254: U1.P93 73.25,42.25 74,43
PD5
  Top 0.254: U1.P92 74.05,41.75 IC3.11
PD6
  Top 0.254: U1.P96 72.25,43.75 73,44.5 74.5,44.5 76,43 76,42.57 IC3.12
PROM_DO  (via drill 0.6)  (1 unrouted)
  Top 0.254: IC1.1 65,30.59 | v63,30.5 65,30.5 | U1.P65 58.5,29.77 v58.5,28.75
  Bottom 0.254: v58.5,28.75 58.5,30.5 v63,30.5
PROM_INITB  (via drill 0.6)
  Top 0.254: U1.P58 54.97,31.47 55,31.5 54.75,31.75 v53.75,31.75 | v62.5,26 64.91,26 IC1.8
  Bottom 0.254: v53.75,31.75 54.75,31.75 55,31.5 55,27.5 62.5,27.5 v62.5,26
PS2CLK  (via drill 0.6)  (1 unrouted)
  Top 0.2: v24,23 19,23
  Top 0.254: U1.P141 45.97,53.03 45.5,53.5
  Bottom 0.2: v24,23 22,23.05 R4.1 21.95,21.05 22,21 22.19,21.19 | T1.2 22.19,21.19 | 22.19,21.19 22.5,21.5 23.95,21.5 R47.2
PS2DAT  (2 unrouted)
  Top 0.254: U1.P140 46.47,53.53 46,54
  Bottom 0.2: R51.2 19.68,15.77 T3.2
R0
  Top 0.254: U1.P56 53.97,25.78 54.25,25.5 54.25,23.25 53,22 R10.1
R1
  Top 0.254: U1.P53 52.47,26.47 51.75,25.75 51.75,23.25 50.5,22 R9.1
RESET  (1 unrouted)
SAA  (1 unrouted)
  Top 0.254: U1.P52 51.97,26.97 50.5,25.5 50.5,24.5
SCART_BLANKING
  Top 0.254: R50.1 51.3,13.3 50.73,12.72 X1.16
SCART_BLUE
  Bottom 0.254: R33.1 R32.1 R31.1 67.95,9.16 X1.7
SCART_COMP  (1 unrouted)
  Bottom 0.254: R14.1 R13.1 45.2,9.2 45,9
SCART_GREEN
  Bottom 0.254: R28.1 R27.1 R26.1 60.45,9.28 X1.11
SCART_LEFT
  Bottom 0.254: X1.3 74.6,9.97 74.6,10.9 73.5,12 C3.2
SCART_RED
  Bottom 0.254: R16.1 R20.1 R15.1 52.7,9.15 X1.15
SCART_RIGHT
  Bottom 0.254: C4.2 79.25,9.13 X1.1
SPI_MISO  (1 unrouted)
  Top 0.254: SV2.4 81.37,37.63 79.5,39.5
SPI_MOSI
  Top 0.254: IC3.16 77.5,38.5 78.75,37.25 SV2.2
SPI_SCLK
  Top 0.254: SV2.3 79.57,35.43 76.25,38.75 76.25,39.42 IC3.15
SPI_SEL
  Top 0.254: SV2.1 74.5,38.75 74.5,38.8 IC3.14
TCK  (via drill 0.6)  (1 unrouted)
  Top 0.254: IC1.6 67.84,27.34 68.3,27.8 68.3,32.3 73.5,37.5 v73.5,38.5 | R2.2 64.67,55.17 66.75,57.25 76,57.25 76,53.5 v79,50.5 | IC3.19 84.09,37.21 84.11,37.23 SV4.7 | 80.75,40.5 79.75,41.5 79.75,42.75 79,43.5 v78.5,43.5
  Bottom 0.254: v79,50.5 81.5,48 81.5,46 79,43.5 v78.5,43.5 78,43.5 73.5,39 v73.5,38.5
TDI_FPGA  (via drill 0.6)
  Top 0.254: v79,45.5 79,44.5 81.75,41.75 IC3.21 81.82,41.68 82.5,41 90.25,41 91.52,42.27 SV4.4
  Bottom 0.2: R1.2 43.06,49.56 44.5,51 44.5,52.25 73.75,52.25
  Bottom 0.254: 73.75,52.25 74.75,52.25 79,48 v79,45.5
TDO_EXP
  Top 0.254: IC3.23 82.95,42.8 83.2,42.8 84,42 88.69,42 88.98,42.29 SV4.3
TDO_FPGA  (via drill 0.6)
  Top 0.254: U1.P109 61.97,50.72 61.5,50.25 v61.25,50.25 | IC1.4 62.89,28.64 v62.75,28.5
  Bottom 0.254: v61.25,50.25 63.75,50.25 64,50 64,28.5 v62.75,28.5
TDO_PROM  (via drill 0.6)
  Top 0.254: IC1.17 69.36,28.64 69,29 69,32 v73.5,36 | 81.5,41 81.43,41 IC3.20 82.43,40 v83,40 82.73,39.77 SV4.5
  Bottom 0.254: v73.5,36 74,36 80,42 80.5,42 82.5,40 v83,40
TMS  (via drill 0.6)  (1 unrouted)
  Top 0.254: R3.2 63.6,57.35 64,58 76.5,58 77,57.5 77,54 v79,52 | v78.5,42.25 78.42,41.75 IC3.18 | v72,37.5 67.5,33 67.5,28 65.96,28 IC1.5 | SV4.9 88.77,34.69 87.75,34.67 85.58,34.67 80.25,40
  Bottom 0.254: v79,52 82.5,48.5 82.5,46 78.5,42 | 78.5,42 v78.5,42.25 | v72,37.5 74,37.5 78.5,42
VCC  (via drill 0.6)  (26 unrouted)
  Top 0.2: R46.2 R39.2 R38.2 | U$6.P8 36.25,52.25 v36.5,52
  Top 0.254: IC1.20 IC1.19 IC1.18 71.21,29.29 v70.5,30 | 59,29.77 U1.P66 59,29.83 59,32.75 v59.25,32.75 59.75,33.25 v62.25,33.25 U1.P75 | U1.P19 v44,40.75 44.5,40.25 48.5,40.25 49,40.75 49.5,40.75 | U1.P3 v44,48.75 | U1.P138 47.47,49.53 v47.5,49 47.25,48.75 v44,48.75 | v62.25,41.25 U1.P91 73.25,41.25 v73.75,40.75 | U1.P126 53.47,46.22 v54,45.75 | 44.25,49 v44,48.75 | v52.5,42.25 51,40.75 v52,39.75 | U1.P54 52.97,35.72 v53.5,36.25 | U1.P106 62,48.75 | U1.P43 47.47,32.75 47.47,32.97 v47.75,33 | U1.P34 44,33.25 v44,33.75 | v58.25,49 59,48.75 58.97,48.78 U1.P115 | v37,21.5 14.5,21.5 13.5,22.5 | v36.5,52 36.5,52.25 | v33.5,67 33.98,66.97 U$2.VDD 34.62,64.5 v52.5,64.5 | 64.75,52.5 65.16,52.5 IC2.8 | IC3.4 75.75,47.75 76.5,47 77.04,47 | 77.04,47 IC3.32 | IC3.32 IC3.31 | IC3.32 79.52,49.52 | 77.04,47 77.75,47 v78,46.75 | v64.25,51.5 64.12,51.88 | R43.1 63.75,62.25 62.5,61 v62.5,60.5 | 93.25,34.45 91.8,34.45 91.5,34.75 | 93.25,34.45 93.25,45.5 92.25,46.5 v90.25,46.5 | v81.5,51 81.5,50.5 80,49 | 93.25,34.45 93.25,30.55 R55.1 | v25,37.5 23.5,37.5 23.5,35 U$4.4
  Top 0.406: U$5.7 11.75,27.39 11.75,26.75 6.65,26.75
  Top 0.6: 49.5,40.75 46.5,43.75 46.5,47.25 44.5,47.25 44.5,48.25 v44,48.75 44,50.5 42.5,50.5 42,51 42,52.25 36.5,52.25 36.25,52.25 9.5,53.25 9.5,36 10.25,35.25 13.5,35.25 13.5,35.5 13,35.5 12.9,35.4 12.6,35.4 U$4.4 | 49.5,40.75 49.5,39.25 46.5,36.25 46.5,32.75 | 49.5,40.75 51,40.75 v56,40.75 | v58.25,49 58.75,49 58.75,43 58,42.25 v58,40.75 58,39.5 59,38.5 | 59,38.75 59,38.5 | 59,38.5 59,33 v59.25,32.75 | 64.75,52.5 64.12,51.88 62.25,50 62.25,48.75 62,48.75 59,48.75 | 46.5,32.75 44.5,32.75 44.5,32.25 43.5,31.25 | 46.5,32.75 47.47,32.75
  Top 0.61: U$5.3 6.65,26.75 U$5.2 | U$5.6 U$5.7
  Bottom 0.2: 16.01,17.96 R6.2 16.05,19.05 16.5,19.5 19,19.5 19.52,19.98 19.5,20.75 T1.3 20.05,20.98 R4.2
  Bottom 0.254: v44,48.75 45.5,48.75 45.25,48.5 C9.1 | v62.25,33.25 61,33.25 60.5,33.75 | v59.25,32.75 58.5,33.25 58.5,33.9 C8.1 59,33.9 C17.1 | v53.5,36.25 53,36.75 C15.1 52.1,39.65 v52,39.75 | v47.5,49 47.5,47.75 | 47.5,47.75 45.6,47.75 45.6,48.65 | v58.25,49 58.75,48 59,47.75 58.85,47.6 C7.1 C13.1 | v54,45.75 53.5,45.75 52.5,44.75 | v52.5,42.25 52.5,44.75 | v58,40.75 58,41.25 60.5,41.25 | 60.5,41.25 61,41.25 | 61,41.25 v62.25,41.25 | 60.9,41.35 61,41.25 | v47.75,33 C14.1 47.5,34.25 46.5,33.25 45.4,33.25 C16.1 45.1,33.25 44.5,33.25 v44,33.75 | C11.1 v44,40.75 | C10.1 60.5,41.25 | 52.5,44.75 C6.1 | C12.1 47.5,47.75 | v37,21.5 44.5,21.5 | 44.5,21.5 52,21.5 | 52,21.5 59.5,21.5 | 59.5,21.5 67,21.5 | 67,21.5 84.5,21.5 | Q5.3 44.15,21 44,21 44.1,21.6 44.5,21.6 44.5,21.5 | Q6.3 52,21.1 52,21.5 | Q8.3 59.5,21.5 | Q7.3 67,21.5 | v36.5,52 C34.1 | 15,21 16.5,19.5 | v33.5,67 33.5,67.5 34,67.5 34.5,67 34.45,66.05 R22.1 35.75,66 35.65,65.9 T2.3 | 14,12.5 14.5,13 14.5,15.5 15,16 15.78,16 T3.3 | R42.1 R45.1 | R45.1 R41.1 R44.1 R40.1 | R45.1 54.7,62.3 v52.5,64.5 | v73.75,40.75 74.25,40.75 78,44.5 v78,46.75 77.75,46.75 77,46 | C29.1 66.5,51.5 v64.25,51.5 | v62.5,60.5 62.5,62.5 | v90.25,46.5 88.75,46.5 81.5,50.5 v81.5,51 | v70.5,30 70.5,29 70,28.5 | U$3.4 25,41.7 v25,37.5
  Bottom 0.6: v56,40.75 v58,40.75
VCC5  (via drill 0.6)  (9 unrouted)
  Top 0.2: v15.5,13.5 25,13.5 25,14.5 v24.25,14.5
  Top 0.406: 5,13.5 6.5,15 32.5,15 33.5,14 33.5,12.5 | 3.5,24.09 3.5,24
  Top 0.6: 3.5,21.5 3.5,24 3.5,32.5 4.31,32.5 4.5,32.69 | REG2.5.3 6.09,48.5 3.5,48.5
  Top 0.61: U$4.3 4.5,32.69 | 3.5,32.5 3.5,48.5 3.5,48.75
  Bottom 0.2: X3.5 17.55,10.95 R7.2 17.55,11.45 v15.5,13.5 | R5.2 v24.25,14.5
  other vias: 93,9 93.59,6.91
VCCAUX  (via drill 0.6)  (1 unrouted)
  Top 0.254: 50,31.75 v49.5,31.75 | 57,32.75 57,29.83 U1.P62 57,30.27 57,26.75 v56.75,26.5 | 57,32.75 57,38.75 51,38.75 50,37.75 50,31.75 | U1.P48 50,29.83 50,31.75 | v56,33 56.5,32.75 57,32.75 | U1.P134 49.47,50.25 | 49.47,50.25 49.47,50.03 v49.5,49.75 | U1.P120 56.47,50.22 | 56.47,50.22 57,49.75 57,43.25 | 49.47,50.25 49.97,49.75 50,49.75 50,43.25 | 56.47,50.22 56.47,49.28 v56.5,49.25 | R50.2 55.5,21 55,21.5 v55,22.5
  Top 0.6: 57,38.75 57,43.25 50,43.25 49.5,43.75 v49,43.75
  Top 0.8: v33,41.25 14.6,41.5 C40.+
  Bottom 0.254: C21.1 49.5,32.65 v49.5,31.75 | C18.1 56,33.9 v56,33 | C19.1 49.5,49.1 v49.5,49.75 | 56.5,47.75 C20.1 v56.5,49.25 | v55,22.5 55,26.25 55.25,26.5 v56.75,26.5
  Bottom 0.6: v49,43.75 44,43.75 44,42.25 35.75,42.25
  Bottom 0.8: 35.75,42.25 33.5,42.25 v33,41.25
VCCINT  (via drill 0.6)  (3 unrouted)
  Top 0.254: U1.P61 56.5,29.83 56.5,31.75 v56,31.75 55.5,31.75 54.5,32.75 54.5,37.25 50.5,37.25 50.5,31.75 | U1.P49 50.5,29.83 50.5,31.75 | 50.5,31.75 v51.25,31.75 | U1.P133 49.97,50.78 50.5,50.25 v51.5,50.25 | 55.5,50.25 56,50.75 56,51.75 | 15,40 15,39
  Top 0.6: v54.5,50.25 55.5,50.25 55.5,45.25 v54.5,44.25 | 54.5,37.25 v54.5,37.75
  Top 0.8: v33,40 15,40
  Bottom 0.254: v56,31.75 55.5,31.75 54.75,32.5 | v51.25,31.75 52,31.75 52,33 | 54.75,32.5 C25.1 | 52,33 54.5,33 54.5,32.75 54.75,32.5 | 52,33 C24.1 | 54.25,50 v54.5,50.25
  Bottom 0.6: v54.5,50.25 v51.5,50.25 52,49.75 C22.1 | C23.1 54.25,50 | v54.5,37.75 54.5,40.75 | 54.5,40.75 v54.5,44.25 | 54.5,40.75 51,40.75 48.5,38.25 44,38.25 44,39.25 36,39.25
  Bottom 0.8: 36,39.25 33.5,39.25 v33,40
XXX  (1 unrouted)
  Top 0.254: U1.P55 53.47,24.97 53,24.5